# EAGLE schematic Stovetop-v1.1 (EAGLE 9.2.2)

## Sheet 1 of 9
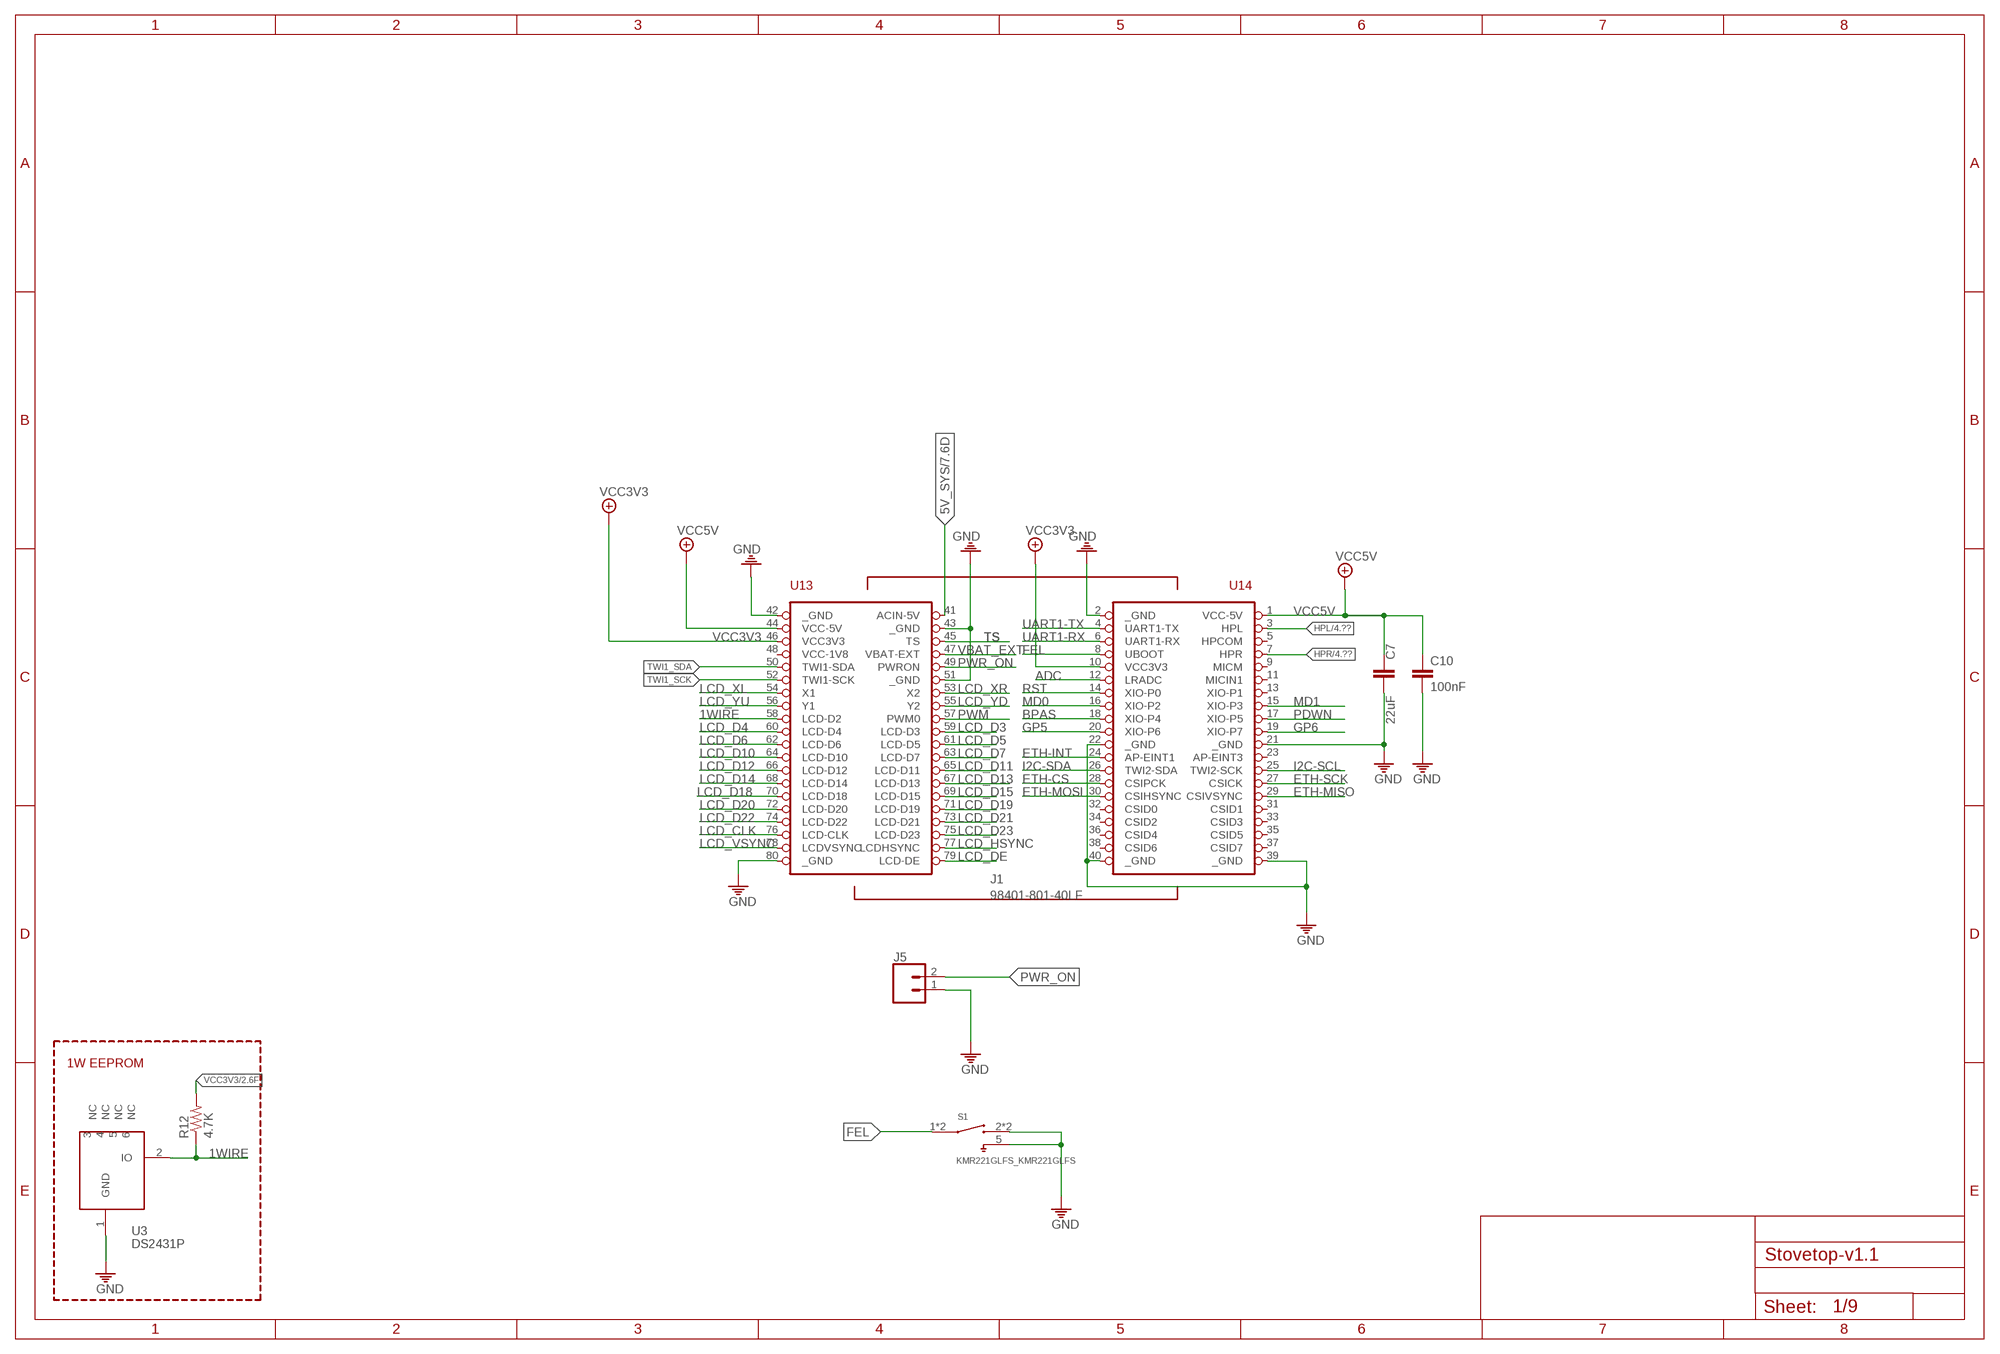
[diagram p0: schematic, sheet 1]

### Parts
C7  22uF  C1206_22UF_50V_10%  [C1206]
C10  100nF  C0402_100NF_50V_10%  [C0402]
J1  98401-801-40LF  [98401-801-40LF]
J5  CONN_02LOCK  [1X02_LOCK]
R12  4.7K  R0402_4K7_5%  [R0402]
S1  KMR221GLFS_KMR221GLFS  [KMR221GLFS_SW_KMR221GLFS]
U3  DS2431P  [TSOC6]

### Nets
1WIRE: J1.58(LCD-D2) R12.1 U3.2(IO)
5V_SYS: J1.41(ACIN-5V) ; also sheet 7,8,9
ADC: J1.12(LRADC)
BPAS: J1.18(XIO-P4) ; also sheet 4
ETH-CS: J1.28(CSIPCK) ; also sheet 2
ETH-INT: J1.24(AP-EINT1) ; also sheet 2
ETH-MISO: J1.29(CSIVSYNC) ; also sheet 2
ETH-MOSI: J1.30(CSIHSYNC) ; also sheet 2
ETH-SCK: J1.27(CSICK) ; also sheet 2
FEL: J1.8(UBOOT) S1.1 S1.4
GND: C7.2 C10.2 J1.2(_GND) J1.21(_GND) J1.22(_GND) J1.39(_GND) J1.40(_GND) J1.42(_GND) J1.43(_GND) J1.51(_GND) J1.80(_GND) J5.1 S1.2 S1.3 S1.5 U3.1(GND) ; also sheet 2,3,4,5,6,7,8,9
GP5: J1.20(XIO-P6)
GP6: J1.19(XIO-P7)
HPL: J1.3(HPL) ; also sheet 4
HPR: J1.7(HPR) ; also sheet 4
I2C-SCL: J1.25(TWI2-SCK) ; also sheet 7
I2C-SDA: J1.26(TWI2-SDA) ; also sheet 7
LCD_CLK: J1.76(LCD-CLK) ; also sheet 5
LCD_D3: J1.59(LCD-D3) ; also sheet 5
LCD_D4: J1.60(LCD-D4) ; also sheet 5
LCD_D5: J1.61(LCD-D5) ; also sheet 5
LCD_D6: J1.62(LCD-D6) ; also sheet 5
LCD_D7: J1.63(LCD-D7) ; also sheet 5
LCD_D10: J1.64(LCD-D10) ; also sheet 5
LCD_D11: J1.65(LCD-D11) ; also sheet 5
LCD_D12: J1.66(LCD-D12) ; also sheet 5
LCD_D13: J1.67(LCD-D13) ; also sheet 5
LCD_D14: J1.68(LCD-D14) ; also sheet 5
LCD_D15: J1.69(LCD-D15) ; also sheet 5
LCD_D18: J1.70(LCD-D18) ; also sheet 5
LCD_D19: J1.71(LCD-D19) ; also sheet 5
LCD_D20: J1.72(LCD-D20) ; also sheet 5
LCD_D21: J1.73(LCD-D21) ; also sheet 5
LCD_D22: J1.74(LCD-D22) ; also sheet 5
LCD_D23: J1.75(LCD-D23) ; also sheet 5
LCD_DE: J1.79(LCD-DE) ; also sheet 5
LCD_HSYNC: J1.77(LCDHSYNC) ; also sheet 5
LCD_VSYNC: J1.78(LCDVSYNC) ; also sheet 5
LCD_XL: J1.54(X1)
LCD_XR: J1.53(X2)
LCD_YD: J1.55(Y2)
LCD_YU: J1.56(Y1)
MD0: J1.16(XIO-P2) ; also sheet 4
MD1: J1.15(XIO-P3) ; also sheet 4
PDWN: J1.17(XIO-P5) ; also sheet 4
PWM: J1.57(PWM0)
PWR_ON: J1.49(PWRON) J5.2
RST: J1.14(XIO-P0) ; also sheet 5
TS: J1.45(TS)
TWI1_SCK: J1.52(TWI1-SCK) ; also sheet 5,6
TWI1_SDA: J1.50(TWI1-SDA) ; also sheet 5,6
UART1-RX: J1.6(UART1-RX) ; also sheet 9
UART1-TX: J1.4(UART1-TX) ; also sheet 9
VBAT_EXT: J1.47(VBAT-EXT)
VCC3V3: J1.10(VCC3V3) J1.46(VCC3V3) R12.2 ; also sheet 2,3,4,5,9
VCC5V: C7.1 C10.1 J1.1(VCC-5V) J1.44(VCC-5V) ; also sheet 3,4
Unconnected: J1.5(HPCOM) J1.9(MICM) J1.11(MICIN1) J1.13(XIO-P1) J1.23(AP-EINT3) J1.31(CSID1) J1.32(CSID0) J1.33(CSID3) J1.34(CSID2) J1.35(CSID5) J1.36(CSID4) J1.37(CSID7) J1.38(CSID6) J1.48(VCC-1V8) U3.3(NC) U3.4(NC) U3.5(NC) U3.6(NC)

### Notes on the sheet
- 1W EEPROM

## Sheet 2 of 9
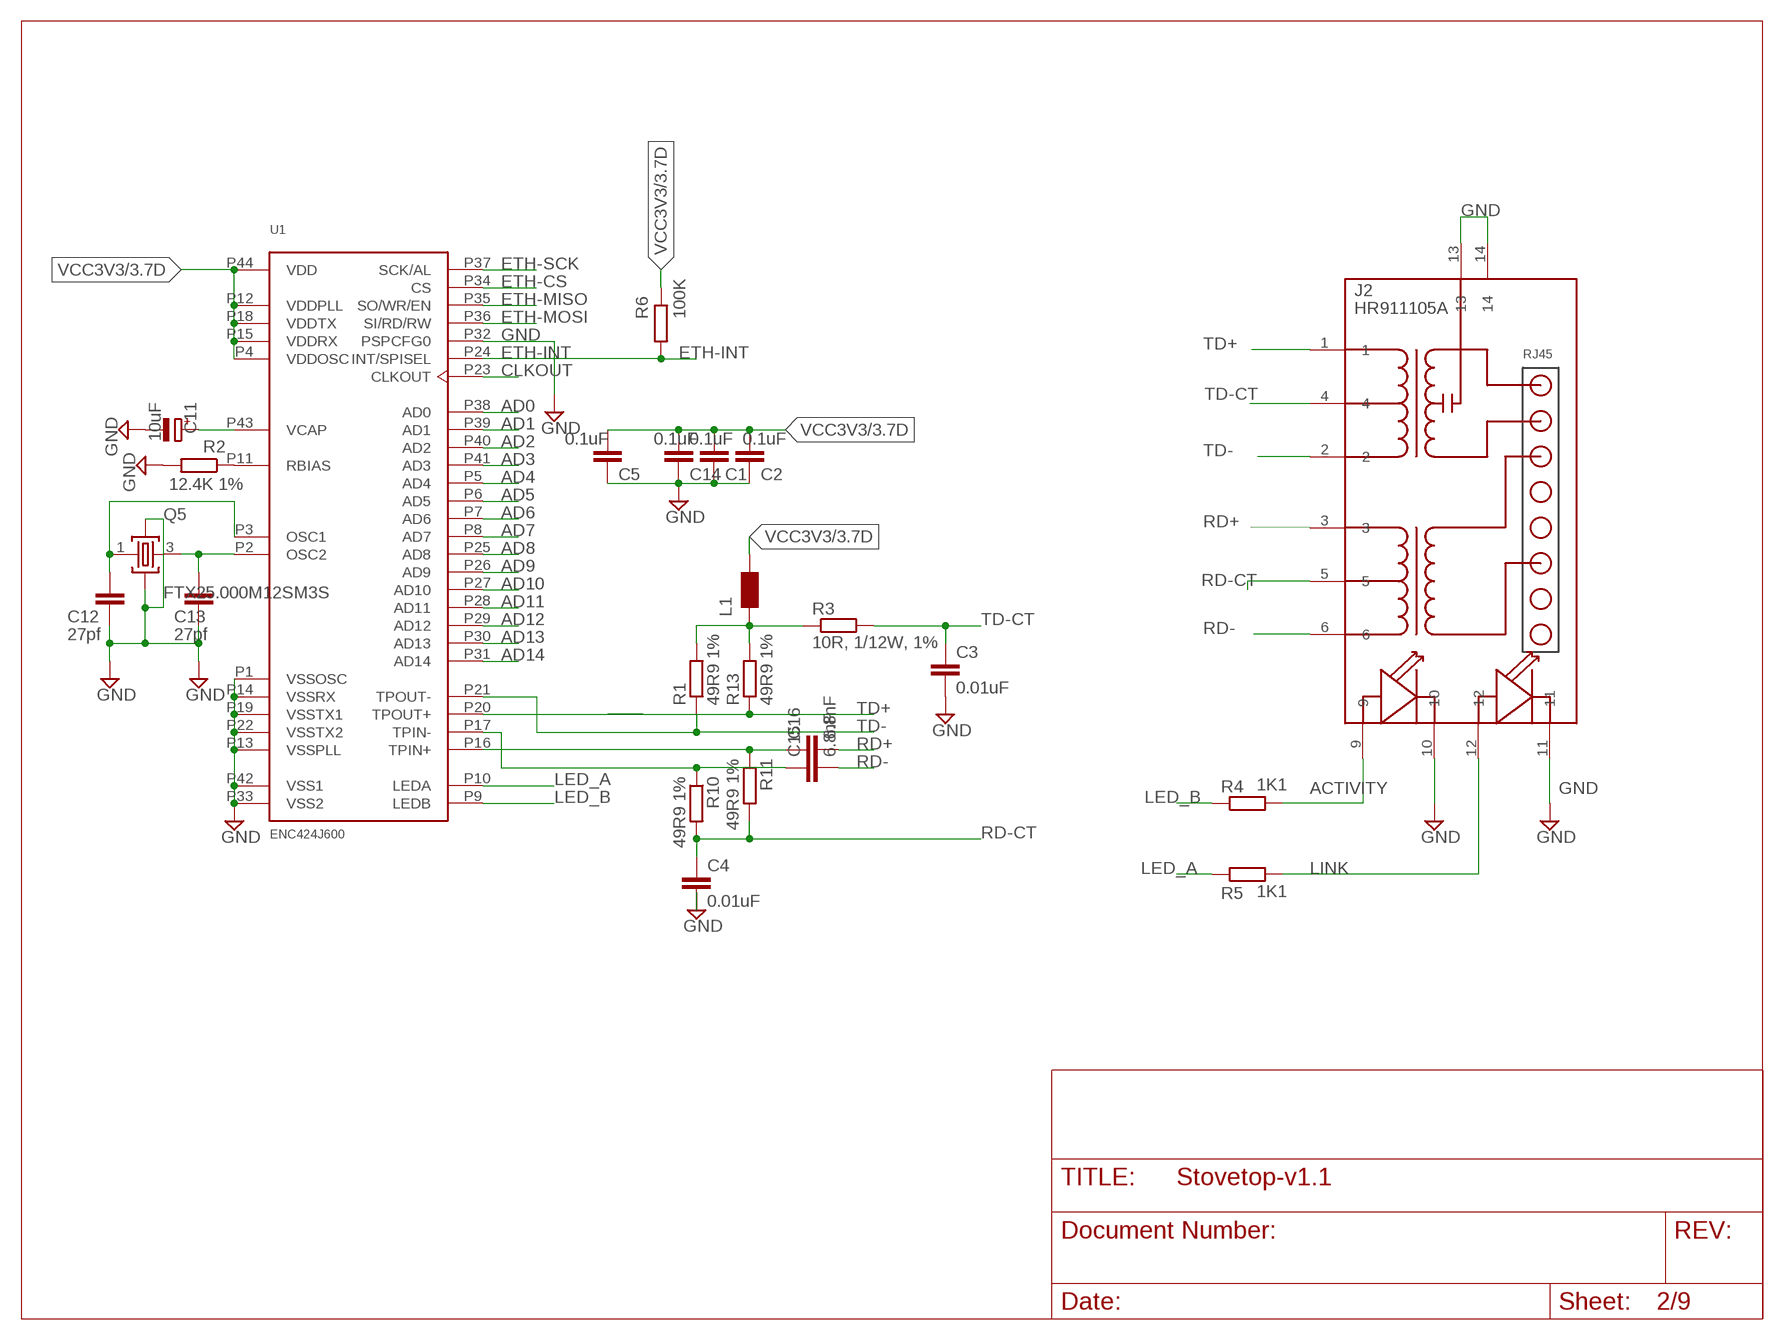
[diagram p1: schematic, sheet 2]

### Parts
C1  0.1uF  C-EUC0603  [C0603]
C2  0.1uF  C-EUC0603  [C0603]
C3  0.01uF  C-EUC0603  [C0603]
C4  0.01uF  C-EUC0603  [C0603]
C5  0.1uF  C-EUC0603  [C0603]
C11  10uF  CPOL-EUSMCA  [SMC_A]
C12  27pf  C-EUC0603  [C0603]
C13  27pf  C-EUC0603  [C0603]
C14  0.1uF  C-EUC0603  [C0603]
C15  6.8nF  C-EUC0603  [C0603]
C16  6.8nF  C-EUC0603  [C0603]
J2  HR911105A  [HR911105A]
L1  WE-KIL_0805  [WE-KI_0805_B]
Q5  FTX25.000M12SM3S  CRISTALLI_0846_FTX25.000M12SM3S  [CRISTALLI_CRYSTAL3.2X2.5]
R1  49R9 1%  R-EU_R0603  [R0603]
R2  12.4K 1%  R-EU_R0603  [R0603]
R3  10R, 1/12W, 1%  R-EU_R0603  [R0603]
R4  1K1  R-EU_R0603  [R0603]
R5  1K1  R-EU_R0603  [R0603]
R6  100K  R-EU_R0603  [R0603]
R10  49R9 1%  R-EU_R0603  [R0603]
R11  49R9 1%  R-EU_R0603  [R0603]
R13  49R9 1%  R-EU_R0603  [R0603]
U1  ENC424J600  [TQFP44]

### Nets
ACTIVITY: J2.9 R4.2
AD0: U1.P38(AD0)
AD1: U1.P39(AD1)
AD2: U1.P40(AD2)
AD3: U1.P41(AD3)
AD4: U1.P5(AD4)
AD5: U1.P6(AD5)
AD6: U1.P7(AD6)
AD7: U1.P8(AD7)
AD8: U1.P25(AD8)
AD9: U1.P26(AD9)
AD10: U1.P27(AD10)
AD11: U1.P28(AD11)
AD12: U1.P29(AD12)
AD13: U1.P30(AD13)
AD14: U1.P31(AD14)
CCT: L1.2 R1.2 R3.1 R13.2
CLKOUT: U1.P23(CLKOUT)
DSFGDF: C15.1 R10.1 U1.P17(TPIN-)
DSGDFSG: C16.1 R11.1 U1.P16(TPIN+)
ETH-CS: U1.P34(CS) ; also sheet 1
ETH-INT: R6.2 U1.P24(INT/SPISEL) ; also sheet 1
ETH-MISO: U1.P35(SO/WR/EN) ; also sheet 1
ETH-MOSI: U1.P36(SI/RD/RW) ; also sheet 1
ETH-SCK: U1.P37(SCK/AL) ; also sheet 1
GND: C1.2 C2.2 C3.2 C4.2 C5.2 C11.- C12.2 C13.2 C14.2 J2.10 J2.11 J2.13 J2.14 Q5.2 Q5.4 R2.2 U1.P1(VSSOSC) U1.P13(VSSPLL) U1.P14(VSSRX) U1.P19(VSSTX1) U1.P22(VSSTX2) U1.P32(PSPCFG0) U1.P33(VSS2) U1.P42(VSS1) ; also sheet 1,3,4,5,6,7,8,9
LED_A: R5.1 U1.P10(LEDA)
LED_B: R4.1 U1.P9(LEDB)
LINK: J2.12 R5.2
N$50: C11.+ U1.P43(VCAP)
N$51: R2.1 U1.P11(RBIAS)
N$73: C12.1 Q5.1 U1.P3(OSC1)
N$74: C13.1 Q5.3 U1.P2(OSC2)
RD+: C16.2 J2.3
RD-: C15.2 J2.6
RD-CT: C4.1 J2.5 R10.2 R11.2
TD+: J2.1 R13.1 U1.P20(TPOUT+)
TD-: J2.2 R1.1 U1.P21(TPOUT-)
TD-CT: C3.1 J2.4 R3.2
VCC3V3: C1.1 C2.1 C5.1 C14.1 L1.1 R6.1 U1.P4(VDDOSC) U1.P12(VDDPLL) U1.P15(VDDRX) U1.P18(VDDTX) U1.P44(VDD) ; also sheet 1,3,4,5,9

## Sheet 3 of 9
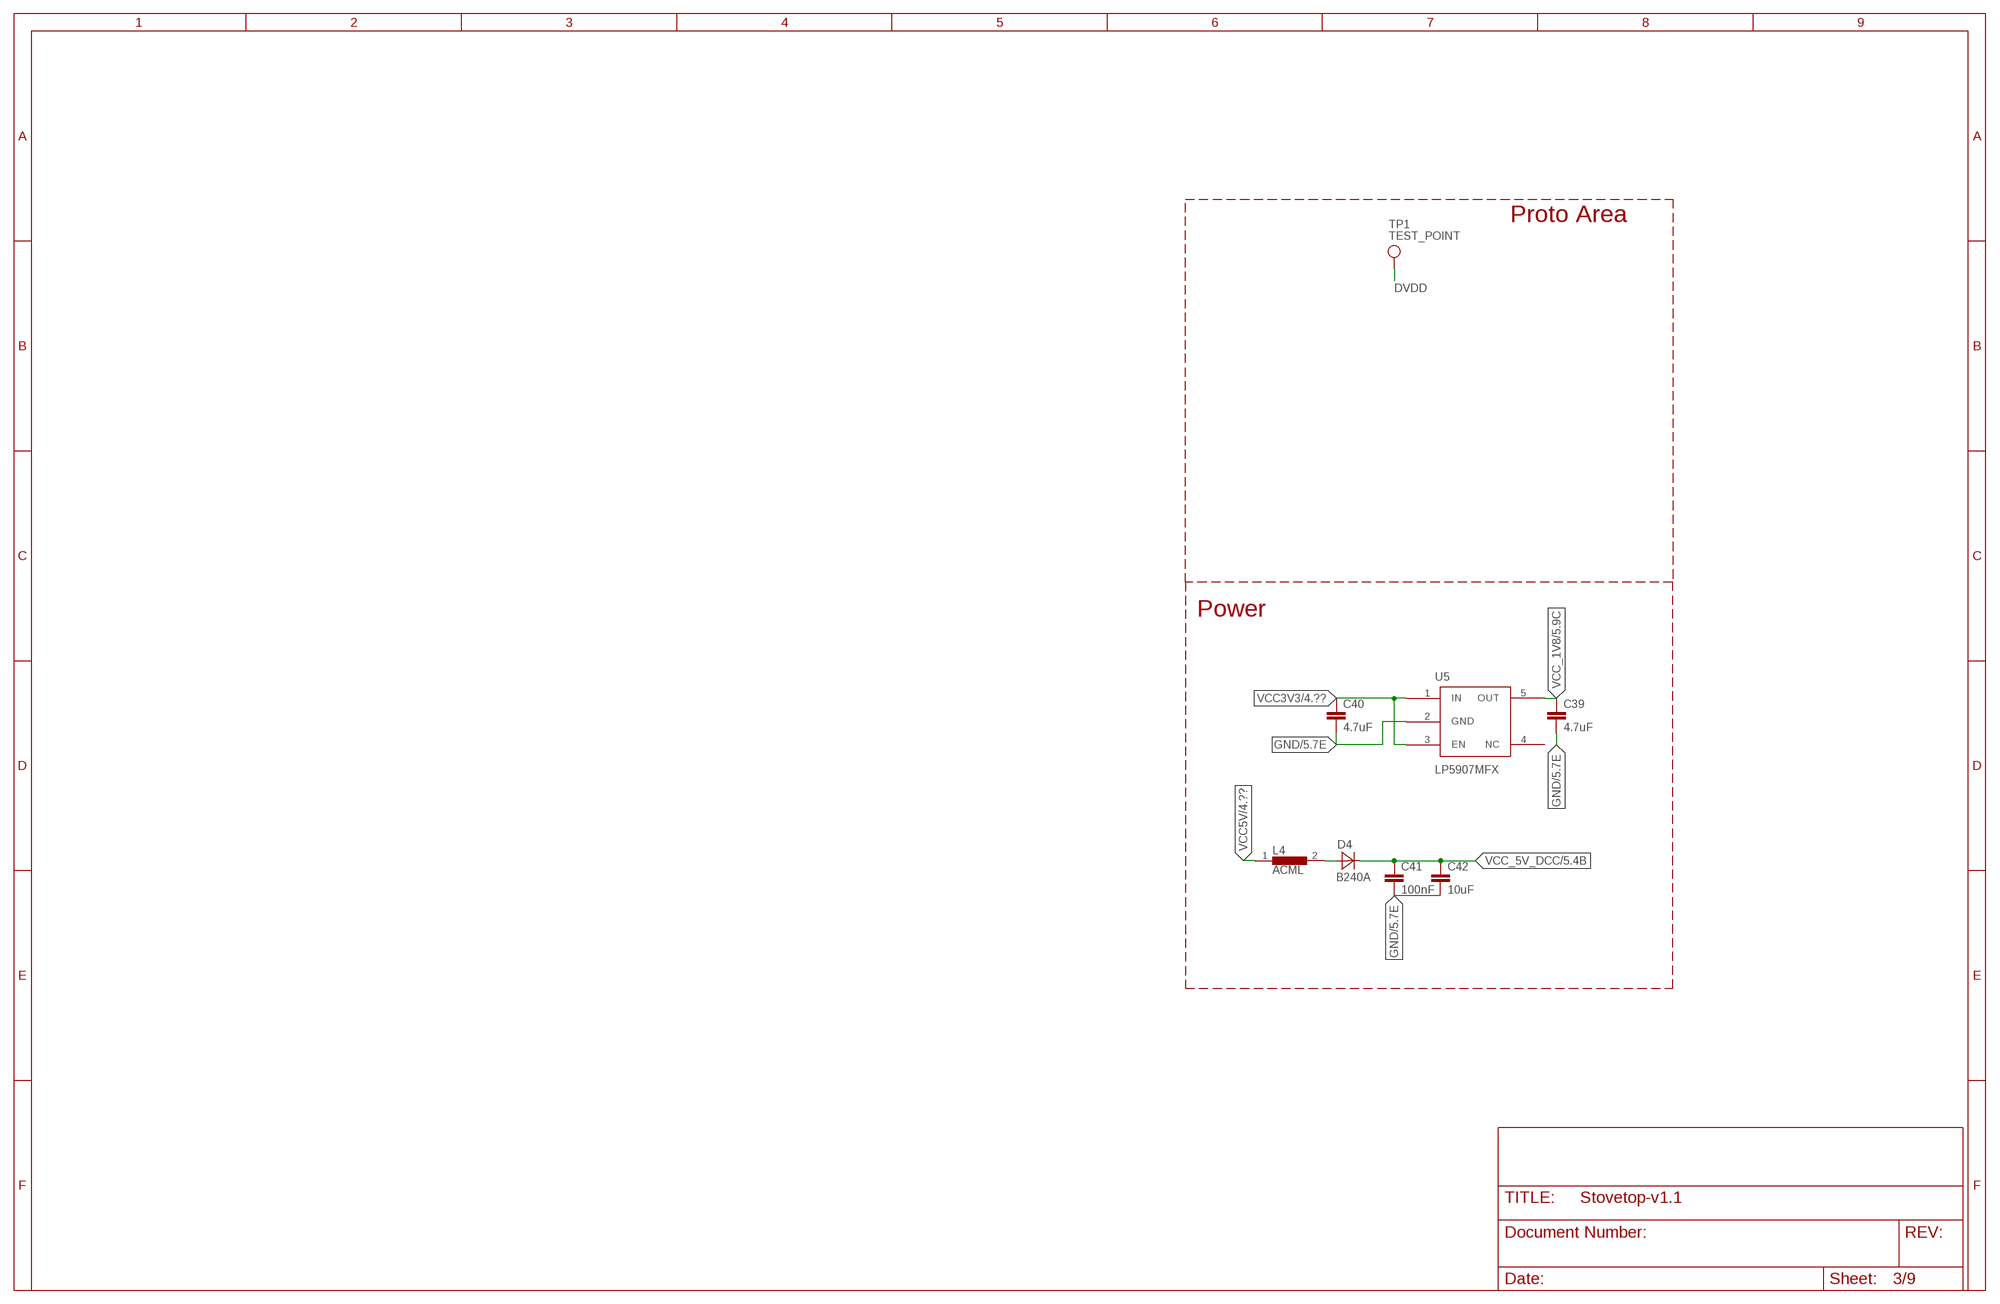
[diagram p2: schematic, sheet 3]

### Parts
C39  4.7uF  CAPACITOR  [1608_0603]
C40  4.7uF  CAPACITOR  [1608_0603]
C41  100nF  CAPACITOR  [1608_0603]
C42  10uF  CAPACITOR  [1608_0603]
D4  B240A  [SMA]
L4  ACML  [0603]
TP1  TEST_POINT  [TP-1MMX1MM]
U5  LP5907MFX  [SOT23-5]

### Nets
DVDD: TP1.0 ; also sheet 5
GND: C39.2 C40.2 C41.2 C42.2 U5.2(GND) ; also sheet 1,2,4,5,6,7,8,9
N$1: D4.1(A) L4.2
VCC3V3: C40.1 U5.1(IN) U5.3(EN) ; also sheet 1,2,4,5,9
VCC5V: L4.1 ; also sheet 1,4
VCC_1V8: C39.1 U5.5(OUT) ; also sheet 5
VCC_5V_DCC: C41.1 C42.1 D4.2(C) ; also sheet 5,6
Unconnected: U5.4(NC)

### Notes on the sheet
- Proto Area
- Power

## Sheet 4 of 9
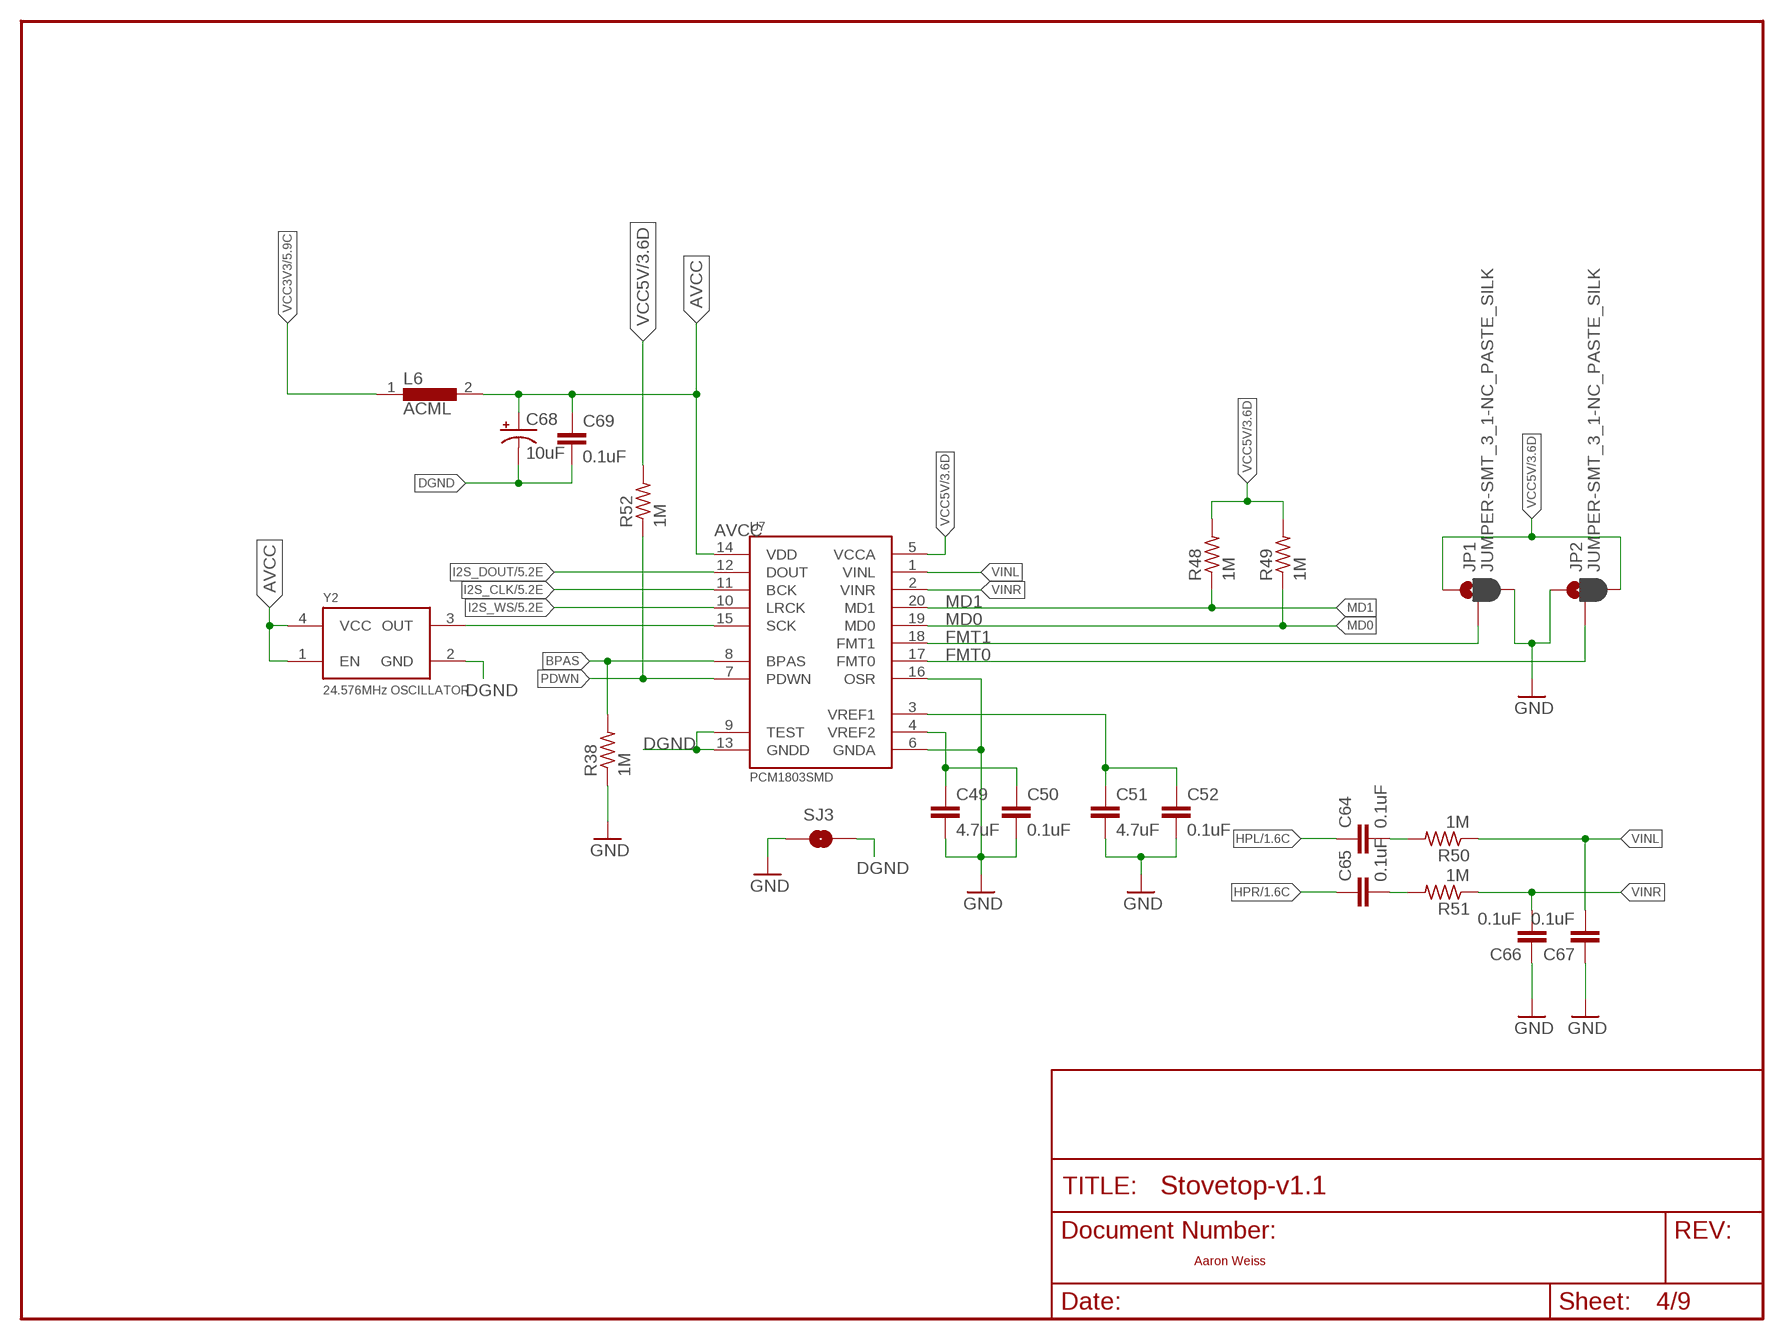
[diagram p3: schematic, sheet 4]

### Parts
C49  4.7uF  4.7UF-0603-6.3V-(10%)  [0603]
C50  0.1uF  CAP0402-CAP  [0402-CAP]
C51  4.7uF  4.7UF-0603-6.3V-(10%)  [0603]
C52  0.1uF  CAP0402-CAP  [0402-CAP]
C64  0.1uF  CAP0402-CAP  [0402-CAP]
C65  0.1uF  CAP0402-CAP  [0402-CAP]
C66  0.1uF  CAP0402-CAP  [0402-CAP]
C67  0.1uF  CAP0402-CAP  [0402-CAP]
C68  10uF  CAP_POL1206  [EIA3216]
C69  0.1uF  CAP0402-CAP  [0402-CAP]
JP1  JUMPER-SMT_3_1-NC_PASTE_SILK  [SMT-JUMPER_3_1-NC_PASTE_SILK]
JP2  JUMPER-SMT_3_1-NC_PASTE_SILK  [SMT-JUMPER_3_1-NC_PASTE_SILK]
L6  ACML  [0603]
R38  1M  RESISTOR  [J1-0603]
R48  1M  RESISTOR  [J1-0603]
R49  1M  RESISTOR  [J1-0603]
R50  1M  RESISTOR  [J1-0603]
R51  1M  RESISTOR  [J1-0603]
R52  1M  RESISTOR  [J1-0603]
SJ3  SOLDERJUMPERTRACE  [SJ_2S-TRACE]
U7  PCM1803SMD  [SSOP20]
Y2  24.576MHz OSCILLATOR  OSCILLATORSMD6  [CRYSTAL-SMD-7.5X5.2-6PIN]

### Nets
AVCC: C68.A(+) C69.1 L6.2 U7.14(VDD) Y2.1(EN) Y2.4(VCC)
BPAS: R38.2 U7.8(BPAS) ; also sheet 1
DGND: C68.C(-) C69.2 SJ3.2 U7.9(TEST) U7.13(GNDD) Y2.2(GND)
FMT0: JP2.2 U7.17(FMT0)
FMT1: JP1.2 U7.18(FMT1)
GND: C49.2 C50.2 C51.2 C52.2 C66.1 C67.1 JP1.3 JP2.1 R38.1 SJ3.1 U7.6(GNDA) U7.16(OSR) ; also sheet 1,2,3,5,6,7,8,9
HPL: C64.1 ; also sheet 1
HPR: C65.1 ; also sheet 1
I2S_CLK: U7.11(BCK) ; also sheet 5
I2S_DOUT: U7.12(DOUT) ; also sheet 5
I2S_WS: U7.10(LRCK) ; also sheet 5
MD0: R49.1 U7.19(MD0) ; also sheet 1
MD1: R48.1 U7.20(MD1) ; also sheet 1
N$37: C49.1 C50.1 U7.4(VREF2)
N$38: C51.1 C52.1 U7.3(VREF1)
N$39: U7.15(SCK) Y2.3(OUT)
N$71: C64.2 R50.2
N$72: C65.2 R51.2
PDWN: R52.1 U7.7(PDWN) ; also sheet 1
VCC3V3: L6.1 ; also sheet 1,2,3,5,9
VCC5V: JP1.1 JP2.3 R48.2 R49.2 R52.2 U7.5(VCCA) ; also sheet 1,3
VINL: C67.2 R50.1 U7.1(VINL)
VINR: C66.2 R51.1 U7.2(VINR)

### Notes on the sheet
- Aaron Weiss

## Sheet 5 of 9
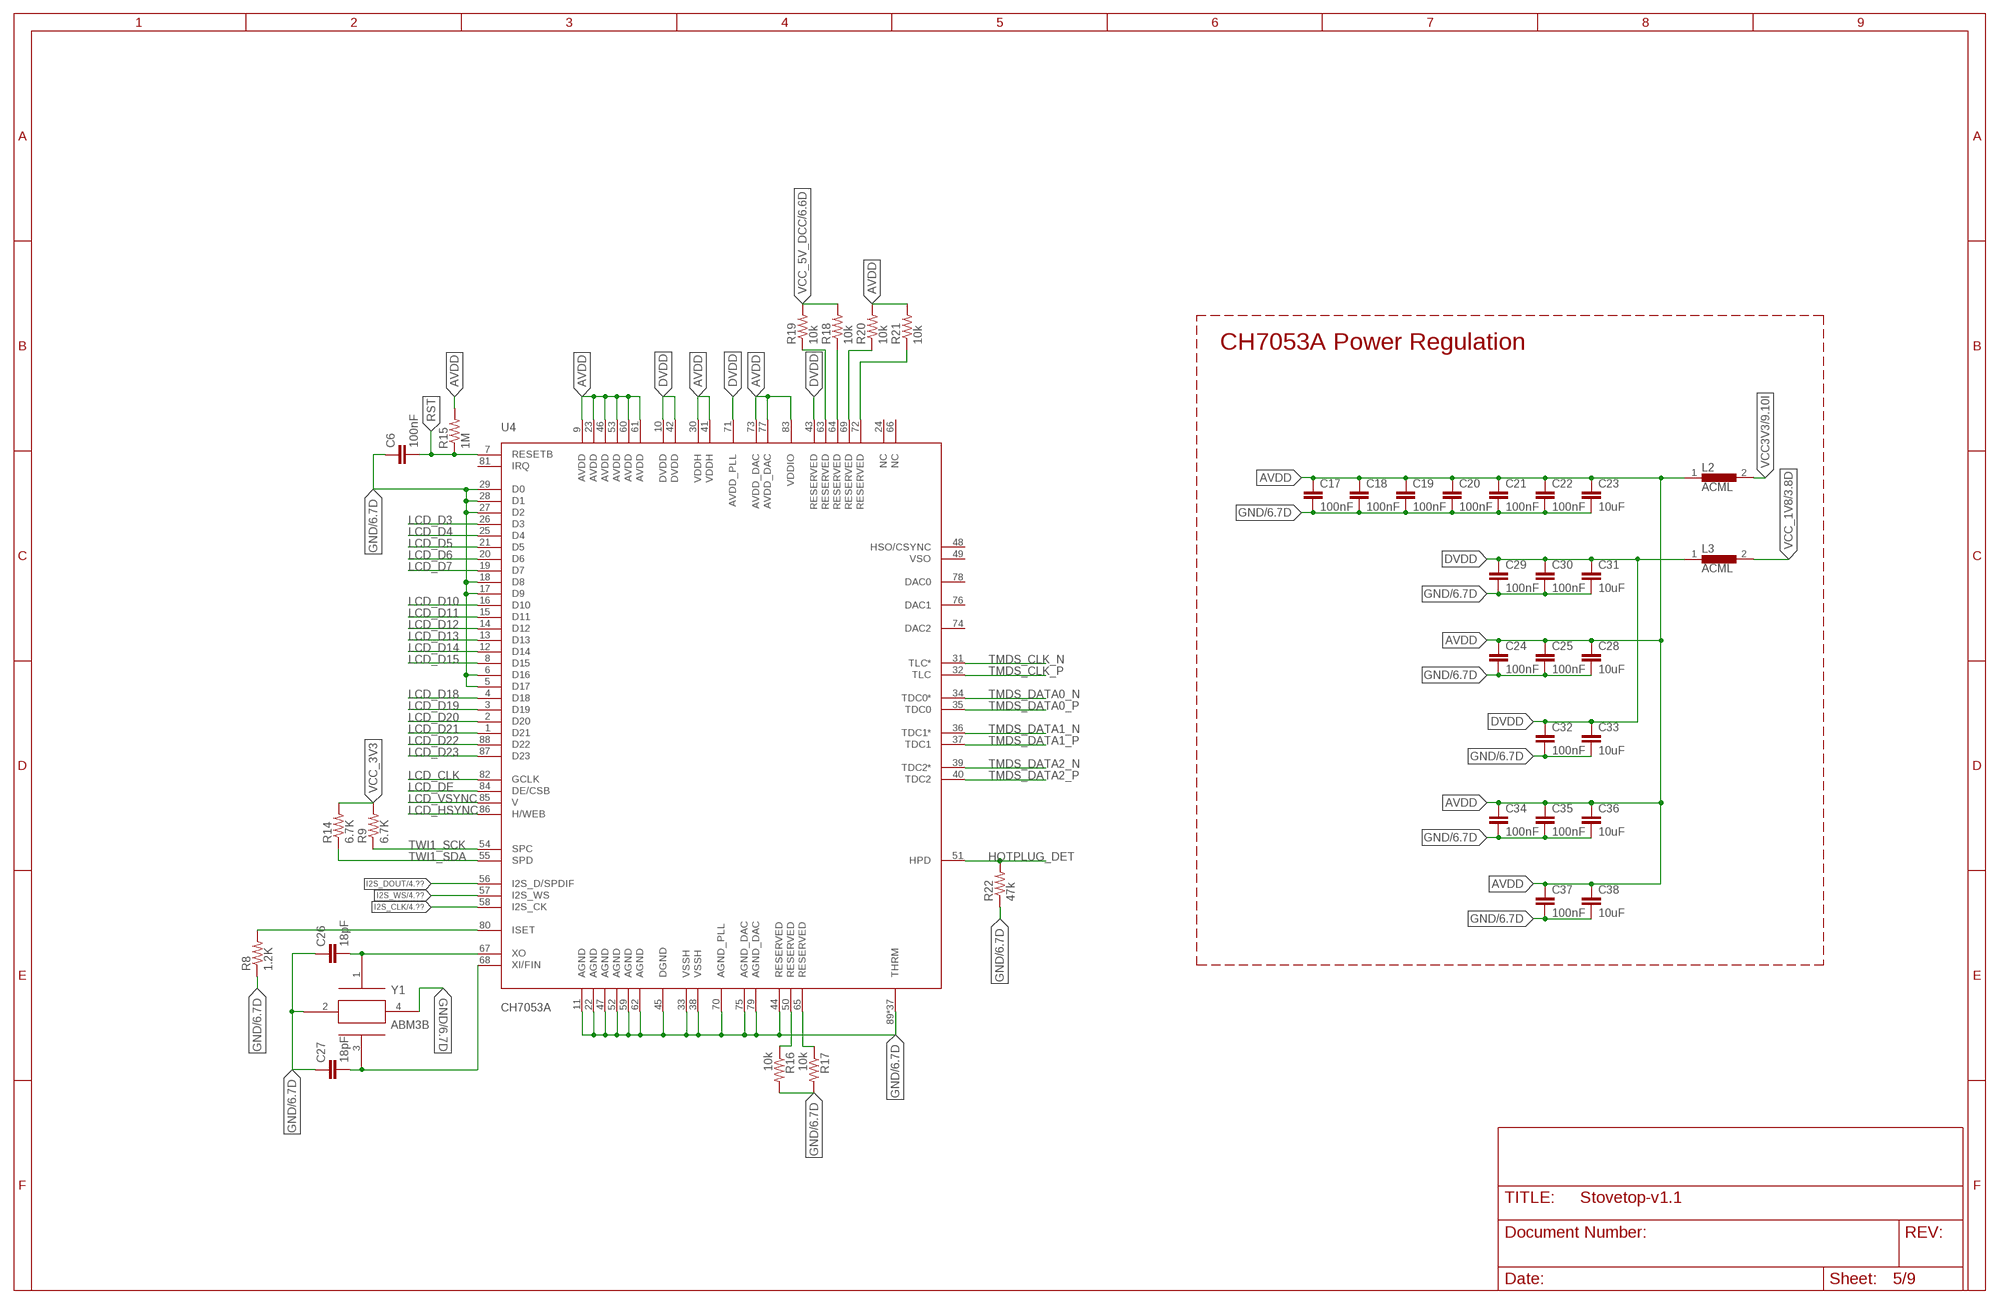
[diagram p4: schematic, sheet 5]

### Parts
C6  100nF  CAPACITOR  [1608_0603]
C17  100nF  CAPACITOR  [1608_0603]
C18  100nF  CAPACITOR  [1608_0603]
C19  100nF  CAPACITOR  [1608_0603]
C20  100nF  CAPACITOR  [1608_0603]
C21  100nF  CAPACITOR  [1608_0603]
C22  100nF  CAPACITOR  [1608_0603]
C23  10uF  CAPACITOR  [1608_0603]
C24  100nF  CAPACITOR  [1608_0603]
C25  100nF  CAPACITOR  [1608_0603]
C26  18pF  CAPACITOR  [1608_0603]
C27  18pF  CAPACITOR  [1608_0603]
C28  10uF  CAPACITOR  [1608_0603]
C29  100nF  CAPACITOR  [1608_0603]
C30  100nF  CAPACITOR  [1608_0603]
C31  10uF  CAPACITOR  [1608_0603]
C32  100nF  CAPACITOR  [1608_0603]
C33  10uF  CAPACITOR  [1608_0603]
C34  100nF  CAPACITOR  [1608_0603]
C35  100nF  CAPACITOR  [1608_0603]
C36  10uF  CAPACITOR  [1608_0603]
C37  100nF  CAPACITOR  [1608_0603]
C38  10uF  CAPACITOR  [1608_0603]
L2  ACML  [0603]
L3  ACML  [0603]
R8  1.2K  RESISTOR  [J1-0603]
R9  6.7K  RESISTOR  [J1-0603]
R14  6.7K  RESISTOR  [J1-0603]
R15  1M  RESISTOR  [J1-0603]
R16  10k  RESISTOR  [J1-0603]
R17  10k  RESISTOR  [J1-0603]
R18  10k  RESISTOR  [J1-0603]
R19  10k  RESISTOR  [J1-0603]
R20  10k  RESISTOR  [J1-0603]
R21  10k  RESISTOR  [J1-0603]
R22  47k  RESISTOR  [J1-0603]
U4  CH7053A  [QFN40P1000X1000X90_HS-89M]
Y1  ABM3B  [ABM3B]

### Nets
AVDD: C17.1 C18.1 C19.1 C20.1 C21.1 C22.1 C23.1 C24.1 C25.1 C28.1 C34.1 C35.1 C36.1 C37.1 C38.1 L2.1 R15.2 R20.2 R21.2 U4.9(AVDD) U4.23(AVDD) U4.30(VDDH) U4.41(VDDH) U4.46(AVDD) U4.53(AVDD) U4.60(AVDD) U4.61(AVDD) U4.73(AVDD_DAC) U4.77(AVDD_DAC) U4.83(VDDIO)
DVDD: C29.1 C30.1 C31.1 C32.1 C33.1 L3.1 U4.10(DVDD) U4.42(DVDD) U4.43(RESERVED) U4.71(AVDD_PLL) ; also sheet 3
GND: C6.1 C17.2 C18.2 C19.2 C20.2 C21.2 C22.2 C23.2 C24.2 C25.2 C26.1 C27.1 C28.2 C29.2 C30.2 C31.2 C32.2 C33.2 C34.2 C35.2 C36.2 C37.2 C38.2 R8.1 R16.2 R17.2 R22.1 U4.5(D17) U4.6(D16) U4.11(AGND) U4.17(D9) U4.18(D8) U4.22(AGND) U4.27(D2) U4.28(D1) U4.29(D0) U4.33(VSSH) U4.38(VSSH) U4.44(RESERVED) U4.45(DGND) U4.47(AGND) U4.52(AGND) U4.59(AGND) U4.62(AGND) U4.70(AGND_PLL) U4.75(AGND_DAC) U4.79(AGND_DAC) U4.89(THRM) U4.P$1(THRM) U4.P$2(THRM) U4.P$3(THRM) U4.P$4(THRM) U4.P$5(THRM) U4.P$6(THRM) U4.P$7(THRM) U4.P$8(THRM) U4.P$9(THRM) U4.P$10(THRM) U4.P$11(THRM) U4.P$12(THRM) U4.P$13(THRM) U4.P$14(THRM) U4.P$15(THRM) U4.P$16(THRM) U4.P$17(THRM) U4.P$18(THRM) U4.P$19(THRM) U4.P$20(THRM) U4.P$21(THRM) U4.P$22(THRM) U4.P$23(THRM) U4.P$24(THRM) U4.P$25(THRM) U4.P$26(THRM) U4.P$27(THRM) U4.P$28(THRM) U4.P$29(THRM) U4.P$30(THRM) U4.P$31(THRM) U4.P$32(THRM) U4.P$33(THRM) U4.P$34(THRM) U4.P$35(THRM) U4.P$36(THRM) Y1.2 Y1.4 ; also sheet 1,2,3,4,6,7,8,9
HOTPLUG_DET: R22.2 U4.51(HPD) ; also sheet 6
I2S_CLK: U4.58(I2S_CK) ; also sheet 4
I2S_DOUT: U4.56(I2S_D/SPDIF) ; also sheet 4
I2S_WS: U4.57(I2S_WS) ; also sheet 4
LCD_CLK: U4.82(GCLK) ; also sheet 1
LCD_D3: U4.26(D3) ; also sheet 1
LCD_D4: U4.25(D4) ; also sheet 1
LCD_D5: U4.21(D5) ; also sheet 1
LCD_D6: U4.20(D6) ; also sheet 1
LCD_D7: U4.19(D7) ; also sheet 1
LCD_D10: U4.16(D10) ; also sheet 1
LCD_D11: U4.15(D11) ; also sheet 1
LCD_D12: U4.14(D12) ; also sheet 1
LCD_D13: U4.13(D13) ; also sheet 1
LCD_D14: U4.12(D14) ; also sheet 1
LCD_D15: U4.8(D15) ; also sheet 1
LCD_D18: U4.4(D18) ; also sheet 1
LCD_D19: U4.3(D19) ; also sheet 1
LCD_D20: U4.2(D20) ; also sheet 1
LCD_D21: U4.1(D21) ; also sheet 1
LCD_D22: U4.88(D22) ; also sheet 1
LCD_D23: U4.87(D23) ; also sheet 1
LCD_DE: U4.84(DE/CSB) ; also sheet 1
LCD_HSYNC: U4.86(H/WEB) ; also sheet 1
LCD_VSYNC: U4.85(V) ; also sheet 1
N$9: C27.2 U4.68(XI/FIN) Y1.3
N$24: R8.2 U4.80(ISET)
N$25: R16.1 U4.50(RESERVED)
N$26: R17.1 U4.65(RESERVED)
N$27: R19.1 U4.63(RESERVED)
N$28: R18.1 U4.64(RESERVED)
N$30: R21.1 U4.72(RESERVED)
N$31: R20.1 U4.69(RESERVED)
N$32: C26.2 U4.67(XO) Y1.1
RST: C6.2 R15.1 U4.7(RESETB) ; also sheet 1
TMDS_CLK_N: U4.31(TLC*) ; also sheet 6
TMDS_CLK_P: U4.32(TLC) ; also sheet 6
TMDS_DATA0_N: U4.34(TDC0*) ; also sheet 6
TMDS_DATA0_P: U4.35(TDC0) ; also sheet 6
TMDS_DATA1_N: U4.36(TDC1*) ; also sheet 6
TMDS_DATA1_P: U4.37(TDC1) ; also sheet 6
TMDS_DATA2_N: U4.39(TDC2*) ; also sheet 6
TMDS_DATA2_P: U4.40(TDC2) ; also sheet 6
TWI1_SCK: R9.1 U4.54(SPC) ; also sheet 1,6
TWI1_SDA: R14.1 U4.55(SPD) ; also sheet 1,6
VCC3V3: L2.2 ; also sheet 1,2,3,4,9
VCC_1V8: L3.2 ; also sheet 3
VCC_3V3: R9.2 R14.2
VCC_5V_DCC: R18.2 R19.2 ; also sheet 3,6
Unconnected: U4.24(NC) U4.48(HSO/CSYNC) U4.49(VSO) U4.66(NC) U4.74(DAC2) U4.76(DAC1) U4.78(DAC0) U4.81(IRQ)

### Notes on the sheet
- CH7053A Power Regulation

## Sheet 6 of 9
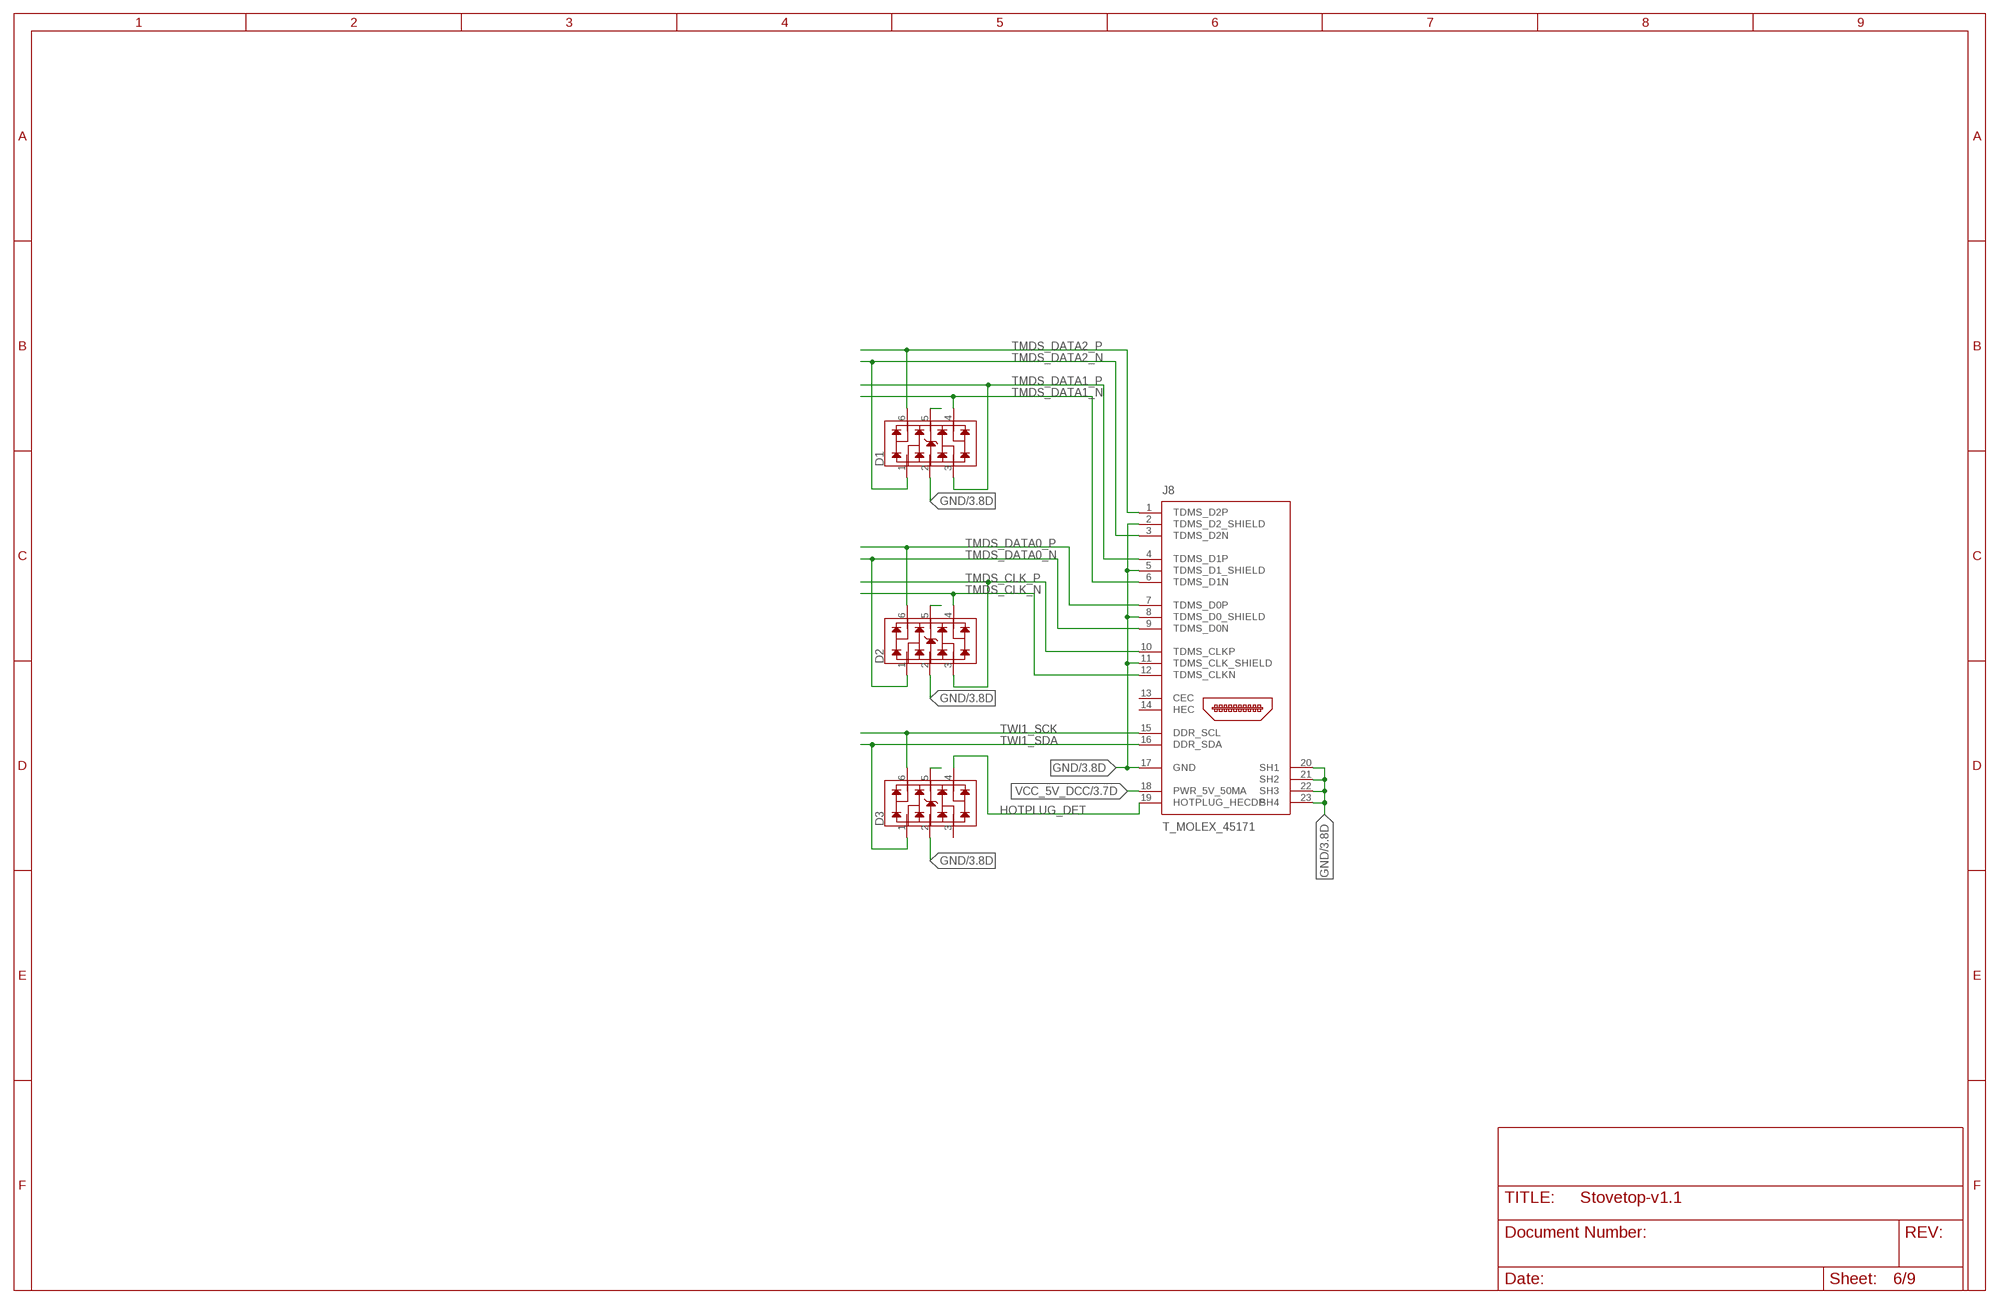
[diagram p5: schematic, sheet 6]

### Parts
D1  D-SEMTECH-RCLAMP0504S  [T_SOT95P285X90-6N]
D2  D-SEMTECH-RCLAMP0504S  [T_SOT95P285X90-6N]
D3  D-SEMTECH-RCLAMP0504S  [T_SOT95P285X90-6N]
J8  T_MOLEX_45171  [T_MOLEX_45171]

### Nets
GND: D1.2 D2.2 D3.2 J8.2(TDMS_D2_SHIELD) J8.5(TDMS_D1_SHIELD) J8.8(TDMS_D0_SHIELD) J8.11(TDMS_CLK_SHIELD) J8.17(GND) J8.20(SH1) J8.21(SH2) J8.22(SH3) J8.23(SH4) ; also sheet 1,2,3,4,5,7,8,9
HOTPLUG_DET: D3.4 J8.19(HOTPLUG_HECDP) ; also sheet 5
N$33: D1.5
N$35: D2.5
N$36: D3.5
TMDS_CLK_N: D2.4 J8.12(TDMS_CLKN) ; also sheet 5
TMDS_CLK_P: D2.3 J8.10(TDMS_CLKP) ; also sheet 5
TMDS_DATA0_N: D2.1 J8.9(TDMS_D0N) ; also sheet 5
TMDS_DATA0_P: D2.6 J8.7(TDMS_D0P) ; also sheet 5
TMDS_DATA1_N: D1.4 J8.6(TDMS_D1N) ; also sheet 5
TMDS_DATA1_P: D1.3 J8.4(TDMS_D1P) ; also sheet 5
TMDS_DATA2_N: D1.1 J8.3(TDMS_D2N) ; also sheet 5
TMDS_DATA2_P: D1.6 J8.1(TDMS_D2P) ; also sheet 5
TWI1_SCK: D3.6 J8.15(DDR_SCL) ; also sheet 1,5
TWI1_SDA: D3.1 J8.16(DDR_SDA) ; also sheet 1,5
VCC_5V_DCC: J8.18(PWR_5V_50MA) ; also sheet 3,5
Unconnected: D3.3 J8.13(CEC) J8.14(HEC)

## Sheet 7 of 9
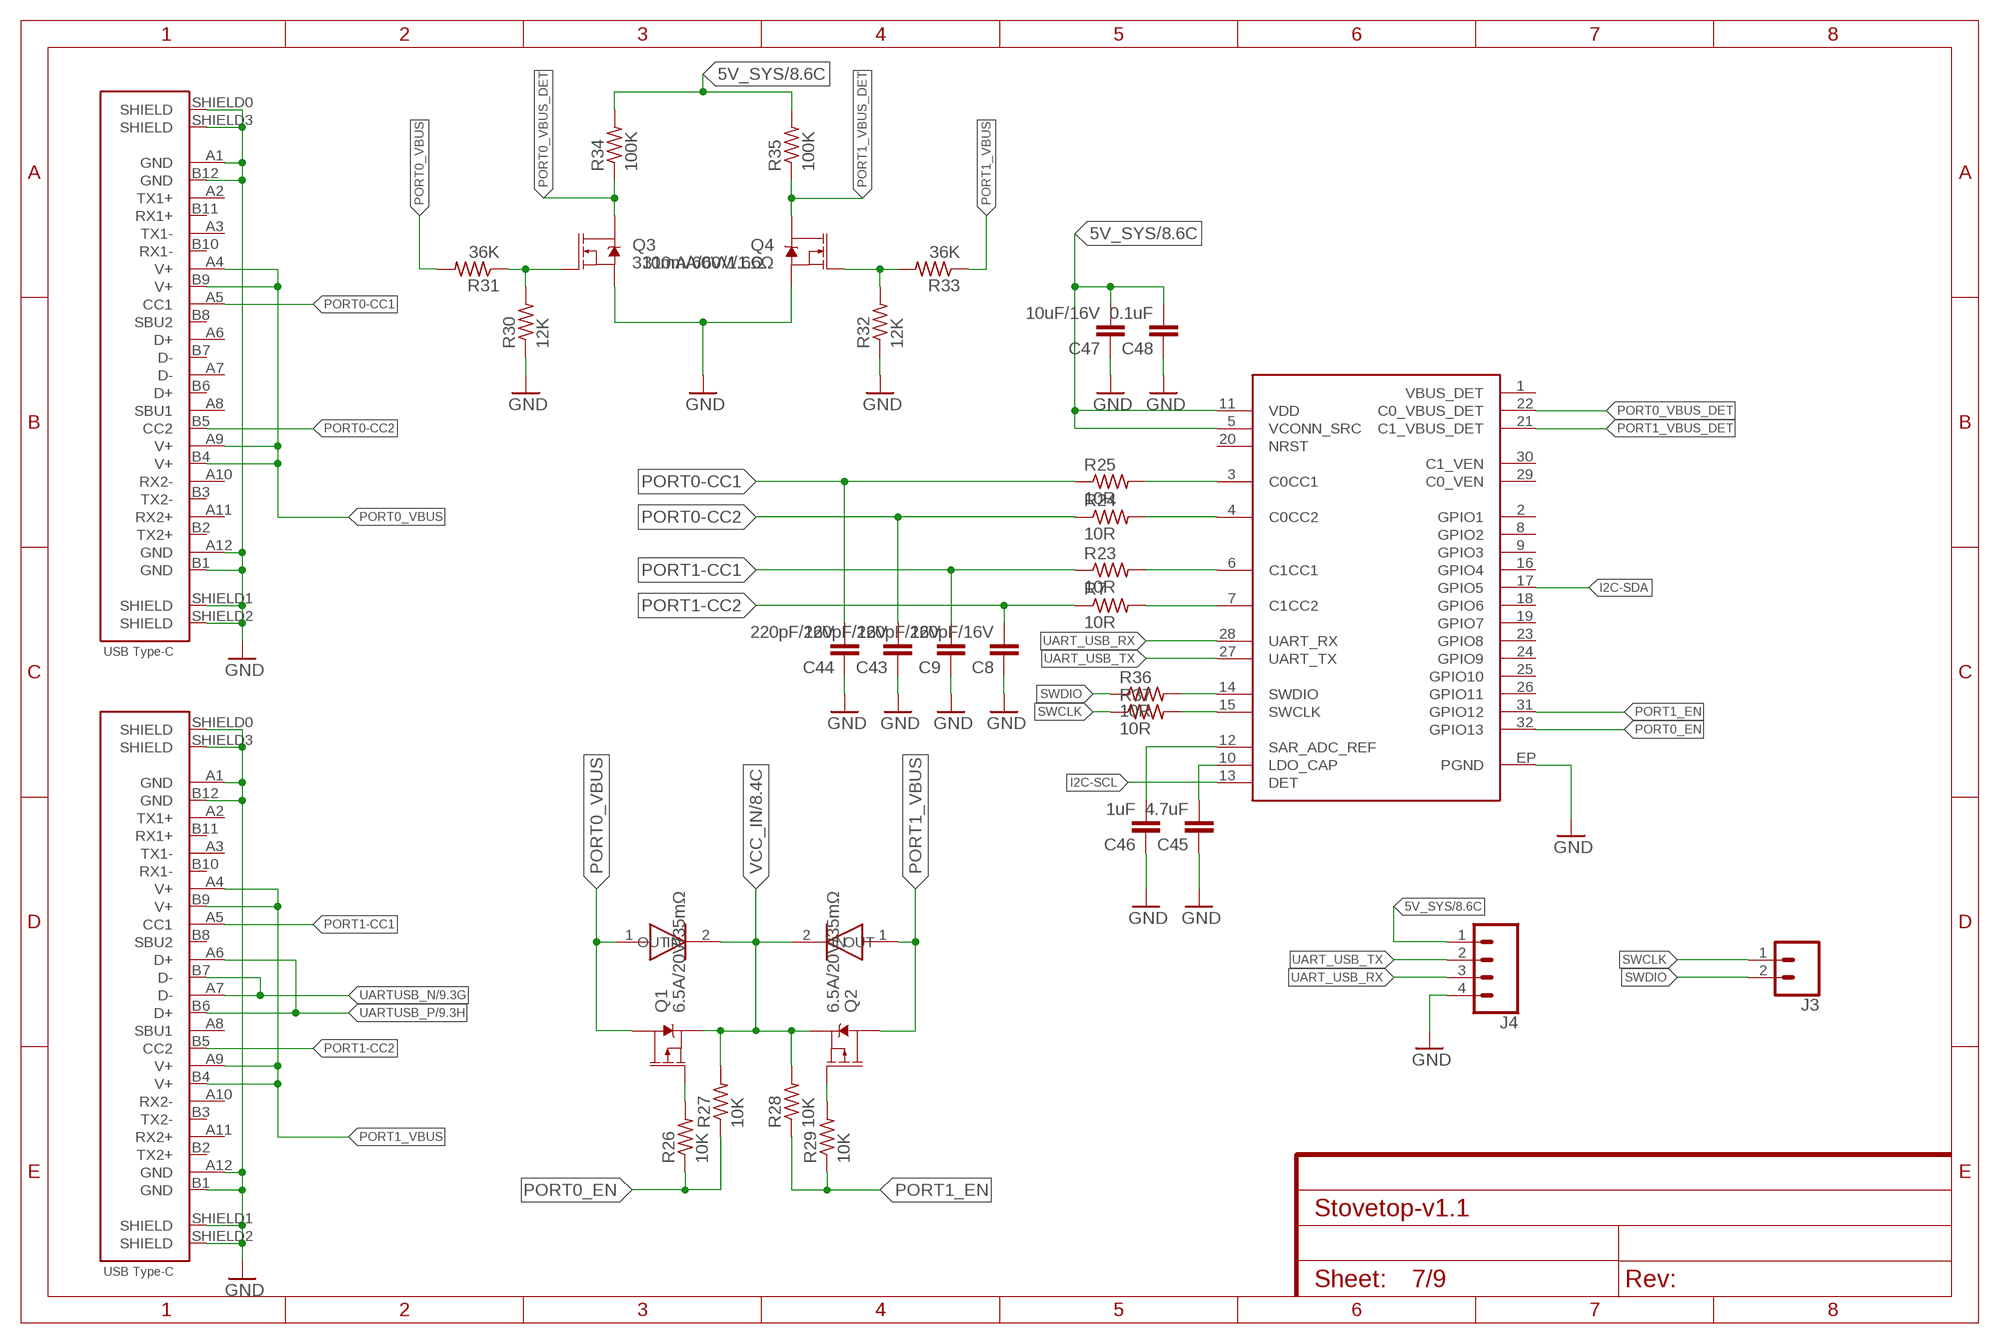
[diagram p6: schematic, sheet 7]

### Parts
C8  220pF/16V  CAP0402-CAP  [0402-CAP]
C9  220pF/16V  CAP0402-CAP  [0402-CAP]
C43  220pF/16V  CAP0402-CAP  [0402-CAP]
C44  220pF/16V  CAP0402-CAP  [0402-CAP]
C45  4.7uF  CAP0402-CAP  [0402-CAP]
C46  1uF  CAP0402-CAP  [0402-CAP]
C47  10uF/16V  CAP0402-CAP  [0402-CAP]
C48  0.1uF  CAP0402-CAP  [0402-CAP]
D5  SMA-SS34  [SMA-SS34]
D6  SMA-SS34  [SMA-SS34]
J3  CONN_02LOCK  [1X02_LOCK]
J4  CONN_04LOCK  [1X04_LOCK]
Q1  6.5A/20V/35mΩ  MOSFET_PCH-NDS8434  [SO08]
Q2  6.5A/20V/35mΩ  MOSFET_PCH-NDS8434  [SO08]
Q3  310mA/60V/1.6Ω  MOSFET-NCH-2N7002PW  [SOT323]
Q4  310mA/60V/1.6Ω  MOSFET-NCH-2N7002PW  [SOT323]
R7  10R  RESISTOR  [J1-0603]
R23  10R  RESISTOR  [J1-0603]
R24  10R  RESISTOR  [J1-0603]
R25  10R  RESISTOR  [J1-0603]
R26  10K  RESISTOR  [J1-0603]
R27  10K  RESISTOR  [J1-0603]
R28  10K  RESISTOR  [J1-0603]
R29  10K  RESISTOR  [J1-0603]
R30  12K  RESISTOR  [J1-0603]
R31  36K  RESISTOR  [J1-0603]
R32  12K  RESISTOR  [J1-0603]
R33  36K  RESISTOR  [J1-0603]
R34  100K  RESISTOR  [J1-0603]
R35  100K  RESISTOR  [J1-0603]
R36  10R  RESISTOR  [J1-0603]
R37  10R  RESISTOR  [J1-0603]
U6  LDR6282  [QFN-32-5X5MM]
USB-C  DX07S024JJ2_USB_TYPE-C  [DX07S0224JJ2_USB-C]
USB-C1  DX07S024JJ2_USB_TYPE-C  [DX07S0224JJ2_USB-C]

### Nets
5V_SYS: C47.2 C48.2 J4.1 R34.2 R35.2 U6.5(VCONN_SRC) U6.11(VDD) ; also sheet 1,8,9
GND: C8.1 C9.1 C43.1 C44.1 C45.1 C46.1 C47.1 C48.1 J4.4 Q3.2(S) Q4.2(S) R30.1 R32.1 U6.EP(PGND) USB-C1.A1(GND) USB-C1.A12(GND) USB-C1.B1(GND) USB-C1.B12(GND) USB-C1.SHIELD0(SHIELD) USB-C1.SHIELD1(SHIELD) USB-C1.SHIELD2(SHIELD) USB-C1.SHIELD3(SHIELD) USB-C.A1(GND) USB-C.A12(GND) USB-C.B1(GND) USB-C.B12(GND) USB-C.SHIELD0(SHIELD) USB-C.SHIELD1(SHIELD) USB-C.SHIELD2(SHIELD) USB-C.SHIELD3(SHIELD) ; also sheet 1,2,3,4,5,6,8,9
I2C-SCL: U6.13(DET) ; also sheet 1
I2C-SDA: U6.17(GPIO5) ; also sheet 1
N$40: R25.2 U6.3(C0CC1)
N$41: R24.2 U6.4(C0CC2)
N$42: R23.2 U6.6(C1CC1)
N$43: R7.2 U6.7(C1CC2)
N$44: C45.2 U6.10(LDO_CAP)
N$45: C46.2 U6.12(SAR_ADC_REF)
N$53: Q1.4(G) R26.2
N$54: Q2.4(G) R29.2
N$57: Q3.1(G) R30.2 R31.1
N$59: Q4.1(G) R32.2 R33.2
N$67: R36.2 U6.14(SWDIO)
N$68: R37.2 U6.15(SWCLK)
PORT0-CC1: C44.2 R25.1 USB-C.A5(CC1)
PORT0-CC2: C43.2 R24.1 USB-C.B5(CC2)
PORT0_EN: R26.1 R27.1 U6.32(GPIO13)
PORT0_VBUS: D5.1(IN) Q1.5(D) Q1.6(D) Q1.7(D) Q1.8(D) R31.2 USB-C.A4(V+) USB-C.A9(V+) USB-C.B4(V+) USB-C.B9(V+)
PORT0_VBUS_DET: Q3.3(D) R34.1 U6.22(C0_VBUS_DET)
PORT1-CC1: C9.2 R23.1 USB-C1.A5(CC1)
PORT1-CC2: C8.2 R7.1 USB-C1.B5(CC2)
PORT1_EN: R28.1 R29.1 U6.31(GPIO12)
PORT1_VBUS: D6.1(IN) Q2.5(D) Q2.6(D) Q2.7(D) Q2.8(D) R33.1 USB-C1.A4(V+) USB-C1.A9(V+) USB-C1.B4(V+) USB-C1.B9(V+)
PORT1_VBUS_DET: Q4.3(D) R35.1 U6.21(C1_VBUS_DET)
SWCLK: J3.1 R37.1
SWDIO: J3.2 R36.1
UART_USB_RX: J4.3 U6.28(UART_RX)
UART_USB_TX: J4.2 U6.27(UART_TX)
UARTUSB_N: USB-C1.A7(D-) USB-C1.B7(D-) ; also sheet 9
UARTUSB_P: USB-C1.A6(D+) USB-C1.B6(D+) ; also sheet 9
VCC_IN: D5.2(OUT) D6.2(OUT) Q1.1(S) Q1.2(S) Q1.3(S) Q2.1(S) Q2.2(S) Q2.3(S) R27.2 R28.2 ; also sheet 8
Unconnected: U6.1(VBUS_DET) U6.2(GPIO1) U6.8(GPIO2) U6.9(GPIO3) U6.16(GPIO4) U6.18(GPIO6) U6.19(GPIO7) U6.20(NRST) U6.23(GPIO8) U6.24(GPIO9) U6.25(GPIO10) U6.26(GPIO11) U6.29(C0_VEN) U6.30(C1_VEN) USB-C1.A2(TX1+) USB-C1.A3(TX1-) USB-C1.A8(SBU1) USB-C1.A10(RX2-) USB-C1.A11(RX2+) USB-C1.B2(TX2+) USB-C1.B3(TX2-) USB-C1.B8(SBU2) USB-C1.B10(RX1-) USB-C1.B11(RX1+) USB-C.A2(TX1+) USB-C.A3(TX1-) USB-C.A6(D+) USB-C.A7(D-) USB-C.A8(SBU1) USB-C.A10(RX2-) USB-C.A11(RX2+) USB-C.B2(TX2+) USB-C.B3(TX2-) USB-C.B6(D+) USB-C.B7(D-) USB-C.B8(SBU2) USB-C.B10(RX1-) USB-C.B11(RX1+)

## Sheet 8 of 9
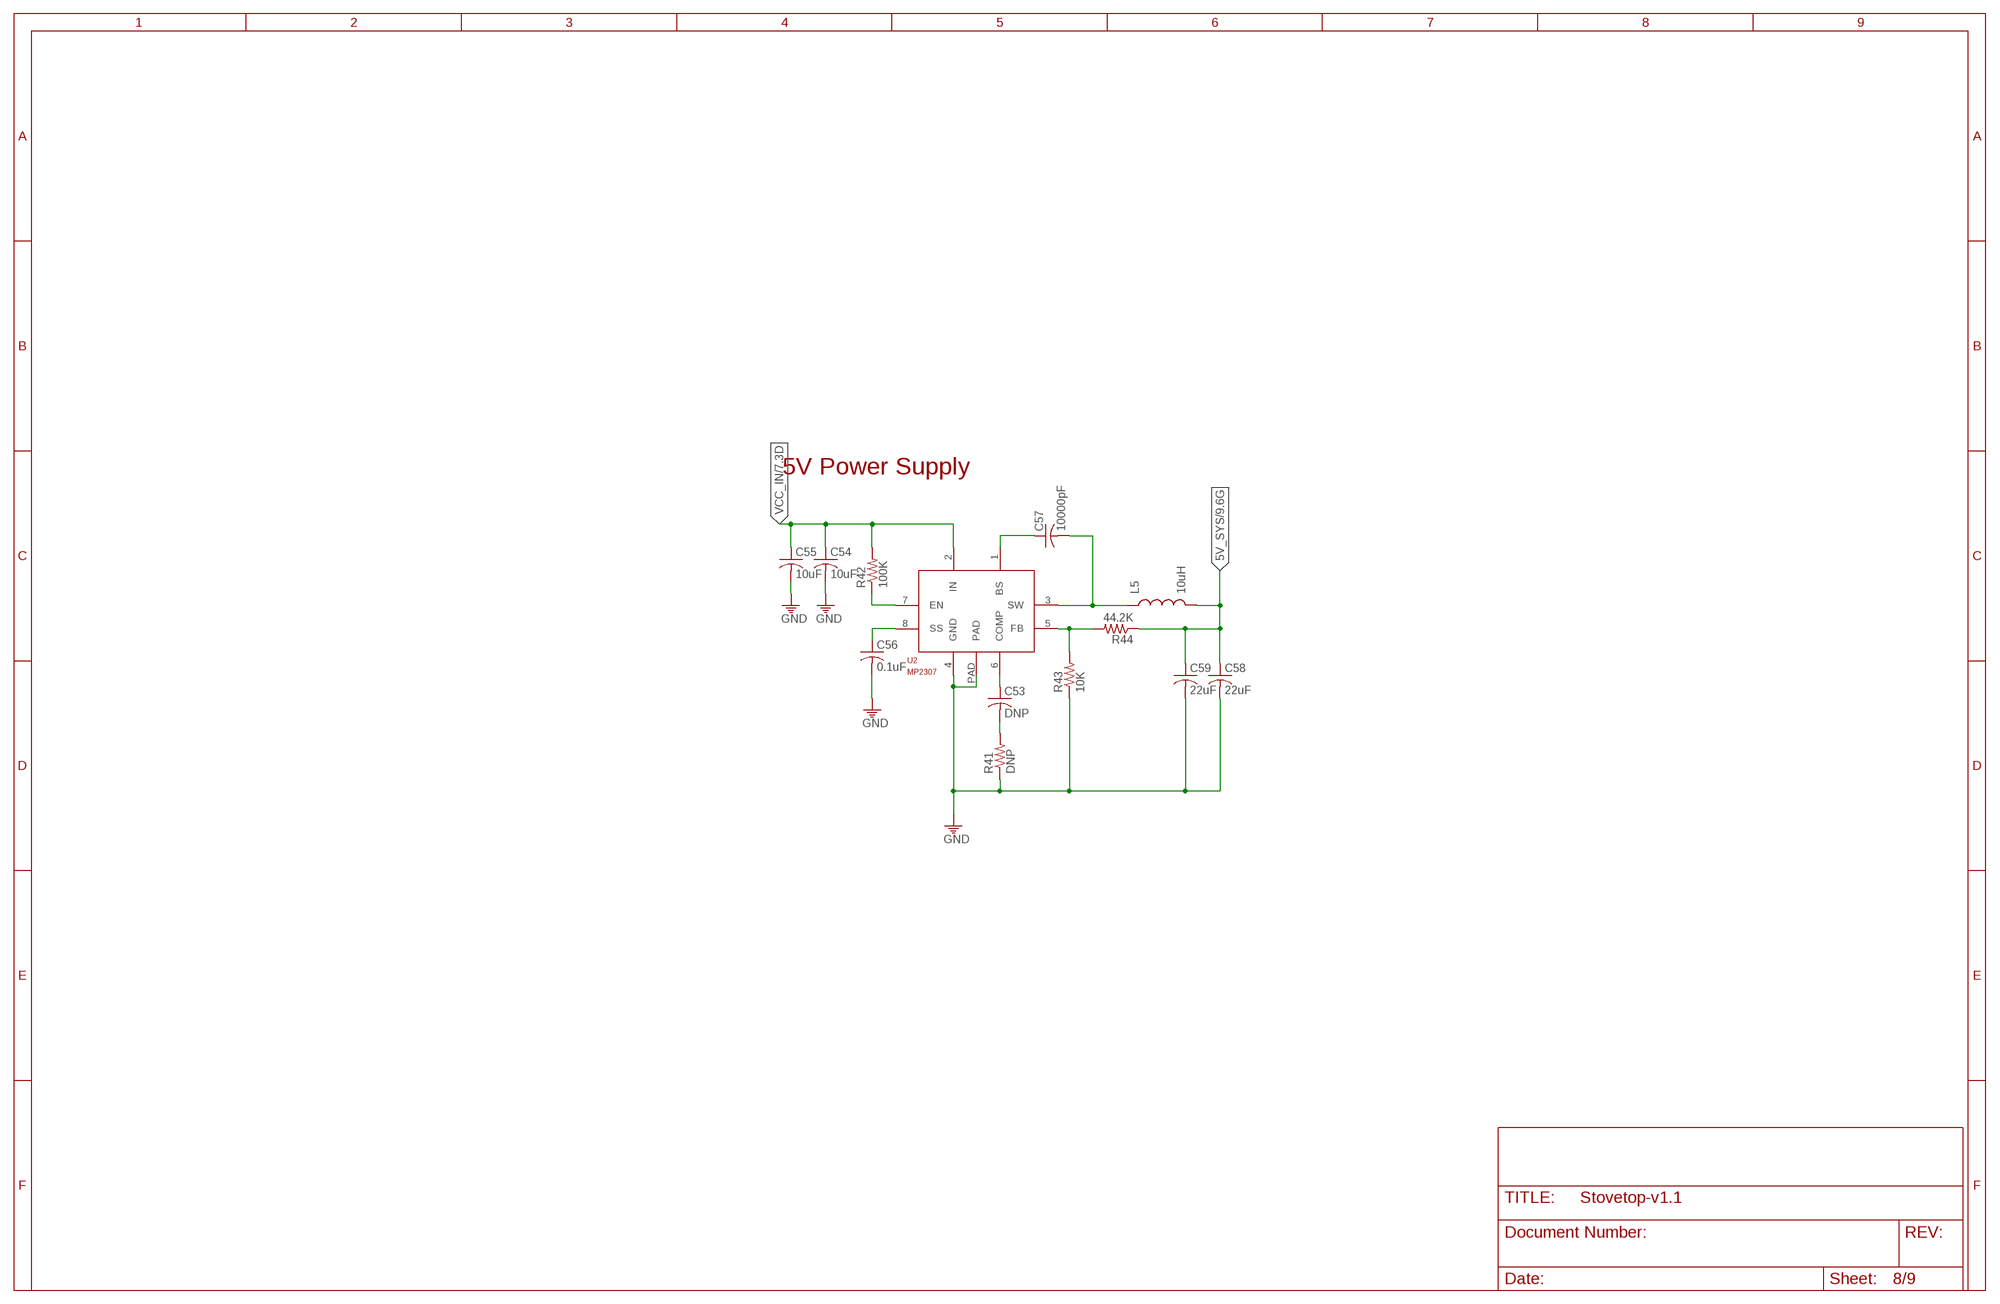
[diagram p7: schematic, sheet 8]

### Parts
C53  DNP  C-USC0402  [C0402]
C54  10uF  C-USC0603  [C0603]
C55  10uF  C-USC0603  [C0603]
C56  0.1uF  C-USC0402  [C0402]
C57  10000pF  C-USC0603  [C0603]
C58  22uF  C-USC0805  [C0805]
C59  22uF  C-USC0805  [C0805]
L5  10uH  INDUCTORNR8040  [INDUCTOR_NR8040]
R41  DNP  R-US_R0402  [R0402]
R42  100K  R-US_R0402  [R0402]
R43  10K  R-US_R0402  [R0402]
R44  44.2K  R-US_R0402  [R0402]
U2  MP2307  [SOIC-8-PAD]

### Nets
5V_SYS: C58.1 C59.1 L5.P$2 R44.1 ; also sheet 1,7,9
GND: C54.2 C55.2 C56.2 C58.2 C59.2 R41.1 R43.1 U2.4(GND) U2.PAD ; also sheet 1,2,3,4,5,6,7,9
N$52: R42.1 U2.7(EN)
N$55: C56.1 U2.8(SS)
N$56: C53.2 R41.2
N$58: C53.1 U2.6(COMP)
N$60: C57.1 U2.1(BS)
N$61: C57.2 L5.P$1 U2.3(SW)
N$62: R43.2 R44.2 U2.5(FB)
VCC_IN: C54.1 C55.1 R42.2 U2.2(IN) ; also sheet 7

### Notes on the sheet
- 5V Power Supply

## Sheet 9 of 9
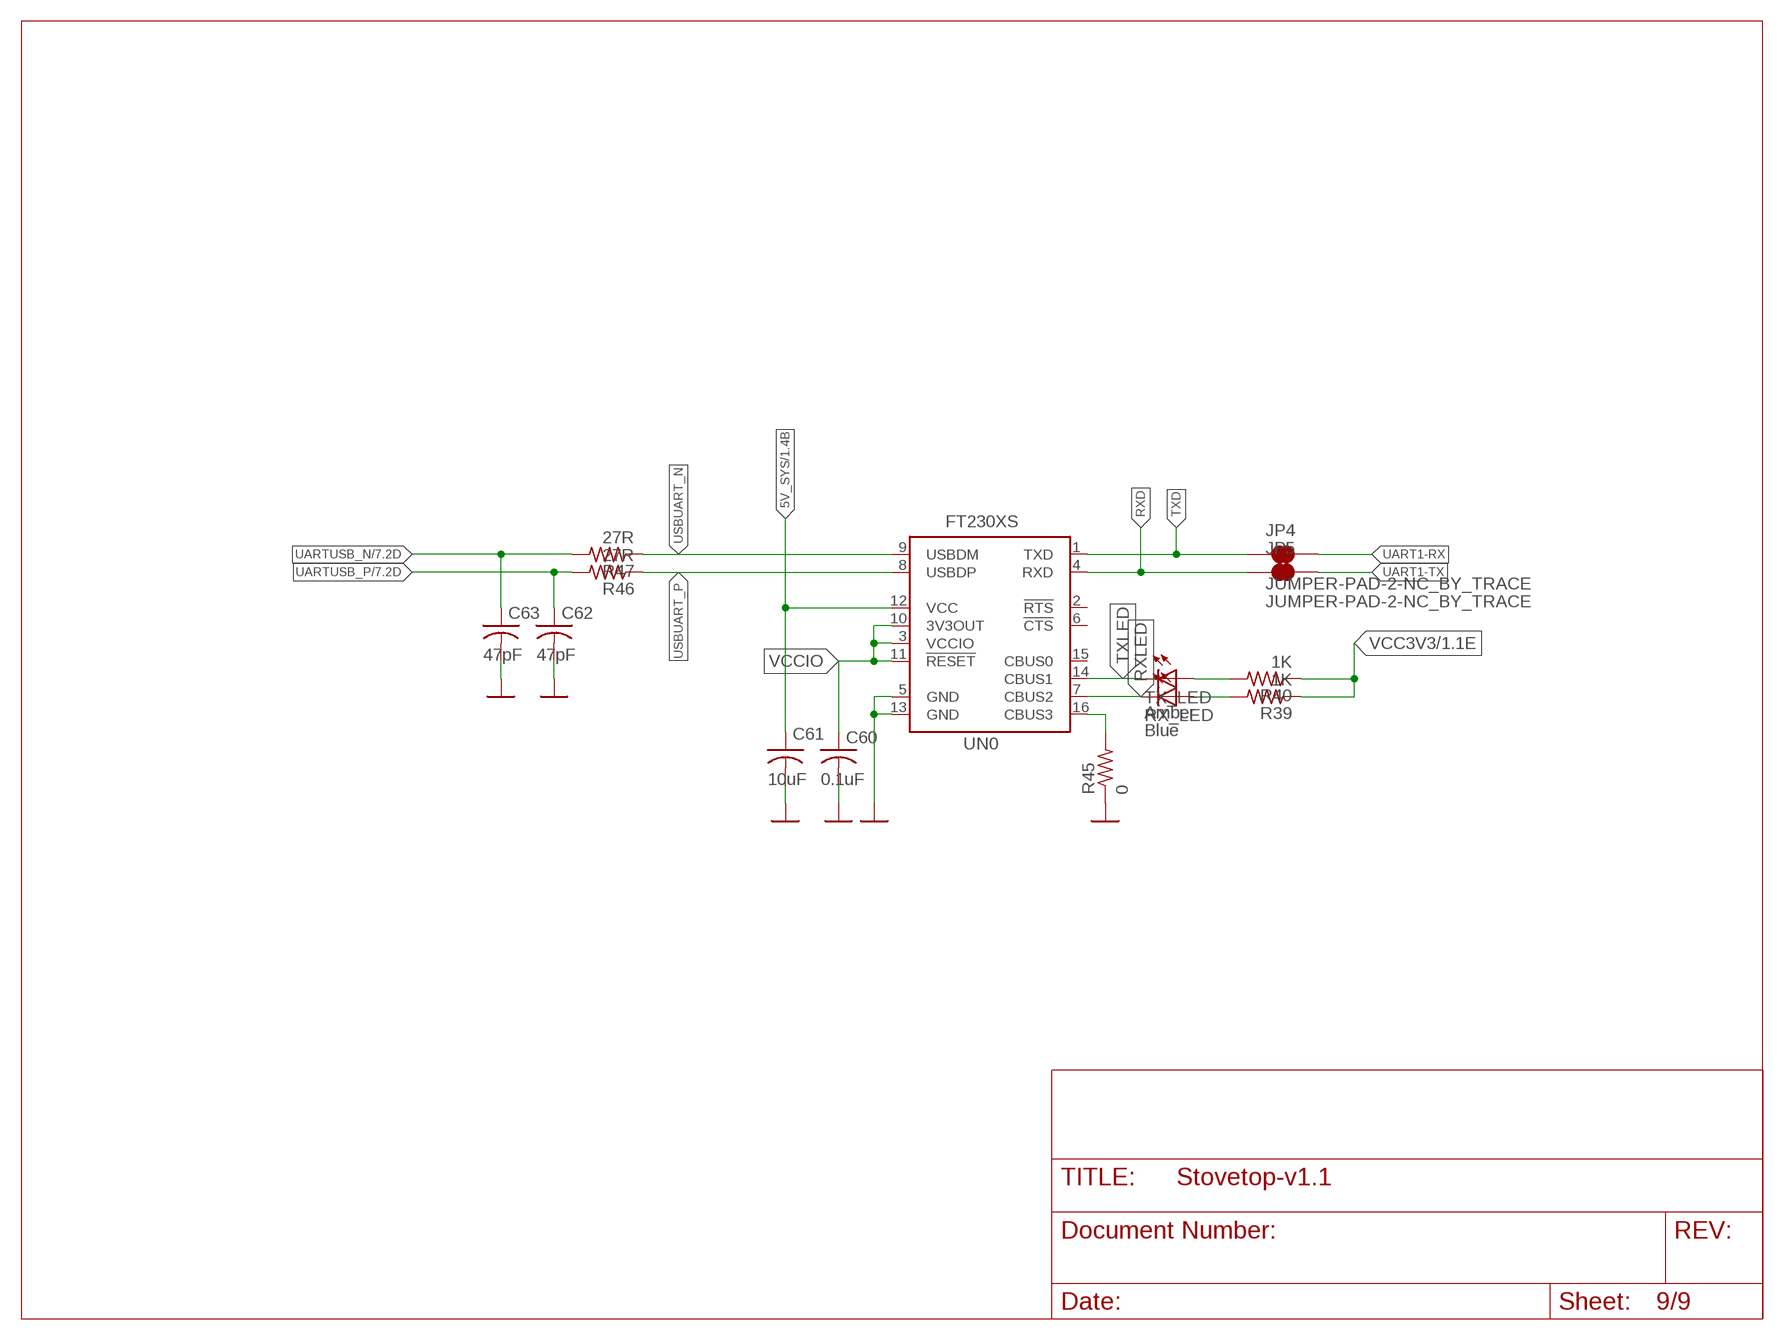
[diagram p8: schematic, sheet 9]

### Parts
C60  0.1uF  C-USC0402  [C0402]
C61  10uF  C-USC0402  [C0402]
C62  47pF  C-USC0402  [C0402]
C63  47pF  C-USC0402  [C0402]
JP4  JUMPER-PAD-2-NC_BY_TRACE  [PAD-JUMPER-2-NC_BY_TRACE_YES_SILK]
JP5  JUMPER-PAD-2-NC_BY_TRACE  [PAD-JUMPER-2-NC_BY_TRACE_YES_SILK]
R39  1K  R-US_R0402  [R0402]
R40  1K  R-US_R0402  [R0402]
R45  0  R-US_R0402  [R0402]
R46  27R  R-US_R0402  [R0402]
R47  27R  R-US_R0402  [R0402]
RX_LED  Blue  LED805  [LED-805]
TX_LED  Amber  LED805  [LED-805]
UN0  FT230XS  [SSOP-16]

### Nets
5V_SYS: C61.1 UN0.12(VCC) ; also sheet 1,7,8
GND: C60.2 C61.2 C62.2 C63.2 R45.1 UN0.5(GND) UN0.13(GND) ; also sheet 1,2,3,4,5,6,7,8
N$63: R45.2 UN0.16(CBUS3)
N$64: R39.2 RX_LED.A
N$65: R40.2 TX_LED.A
RXD: JP5.1 UN0.4(RXD)
RXLED: RX_LED.C UN0.7(CBUS2)
TXD: JP4.1 UN0.1(TXD)
TXLED: TX_LED.C UN0.14(CBUS1)
UART1-RX: JP4.2 ; also sheet 1
UART1-TX: JP5.2 ; also sheet 1
UARTUSB_N: C63.1 R47.2 ; also sheet 7
UARTUSB_P: C62.1 R46.2 ; also sheet 7
USBUART_N: R47.1 UN0.9(USBDM)
USBUART_P: R46.1 UN0.8(USBDP)
VCC3V3: R39.1 R40.1 ; also sheet 1,2,3,4,5
VCCIO: C60.1 UN0.3(VCCIO) UN0.10(3V3OUT) UN0.11(!RESET)
Unconnected: UN0.2(!RTS) UN0.6(!CTS) UN0.15(CBUS0)

## Library data of the parts
C1-C5 C12-C16 = rcl:C-EU: CAPACITOR, European symbol
C6 C17-C42 = CHIP_HDMI:CAPACITOR
C7 = Keyboard v0_5:C1206_22UF_50V_10%; DESCRIPTION: CAP ceramic smd 20% 35V 1206; FOOTPRINT: C1206; LINK: http://www.digikey.com/product-detail/en/C3216X5R1V226M160AC/445-8045-1-ND/2792165; MFG: DIGIKEY; MFG_PN: 445-8045-1-ND; PART_TYPE: C1206; PRICE: 0.01; TOLLERANCE: 20%; VENDOR: TDK; VENDOR_PART_NUMBER: C3216X5R1V226M160AC
C8 C9 C43-C48 C50 C52 C64-C67 C69 = SparkFun:CAP: Capacitor Standard 0603 ceramic capacitor, and 0.1" leaded capacitor.
C10 = Keyboard v0_5:C0402_100NF_50V_10%; DESCRIPTION: CAP CER SMD 100nF 25V 10% 0402; FOOTPRINT: C0402; LINK: http://www.digikey.co.il/product-detail/en/C1005X5R1E104K050BC/445-4964-1-ND/2093578; MFG: DIGIIKEY; MFG_PN: 445-4964-1-ND; PART_TYPE: C0402; PRICE: 0.01; TOLLERANCE: 10%; VENDOR: TDK; VENDOR_PART_NUMBER: C1005X5R1E104K050BC
C11 = rcl:CPOL-EU: POLARIZED CAPACITOR, European symbol
C49 C51 = SparkFun-Capacitors:4.7UF: 4.7µF ceramic capacitors A capacitor is a passive two-terminal electrical component used to store electrical energy temporarily in an electric field.; PROD_ID: CAP-08280
C53-C56 = GR8_Module-Eval-v0.1:C-US: CAPACITOR, American symbol
C57-C63 = CHIP_PRO_Dev-Kit-v0.1:C-US: CAPACITOR, American symbol
C68 = SparkFun:CAP_POL: Capacitor Polarized These are standard SMD and PTH capacitors. Normally 10uF, 47uF, and 100uF in electrolytic and tantalum varieties. Always verify the external diameter of the through hole cap, it varies with capacity, voltage, and manufacturer. The EIA devices should be standard.
D1-D3 = CHIP_HDMI:D-SEMTECH-RCLAMP0504S
D4 = CHIP_HDMI:B240A
D5 D6 = SMA-SS34:SMA-SS34
J1 = PocketCHIP-v1.0:98401-801-40LF
J2 = CONNECTER:HR911105A
J3 J5 = Stovetop:CONN_02: Multi connection point. Often used as Generic Header-pin footprint for 0.1 inch spaced/style header connections On any of the 0.1 inch spaced packages, you can populate with these: Break Away Headers - Straight <https://www.sparkfun.com/products/116> (PRT-00116) Break Away Male Headers - Right Angle <https://www.sparkfun.com/products/553> (PRT-00553) Female Headers <https://www.sparkfun.com/products/115> (PRT-00115) Break Away Headers - Machine Pin <https://www.sparkfun.com/products/117> (PRT-00117) Break Away Female Headers - Swiss Machine Pin <https://www.sparkfun.com/products/743> (PRT-00743) For SCREWTERMINALS and SPRING TERMINALS visit here: Screw Terimnals on SparkFun.com <https://www.sparkfun.com/search/results?term=Screw+Terminals> (5mm/3.5mm/2.54mm spacing) This device is also useful as a general connection point to wire up your design to another part of your project. Our various solder wires solder well into these plated through hole pads. Hook-Up Wire - Assortment (Stranded, 22 AWG) <https://www.sparkfun.com/products/11375> (PRT-11375) Hook-Up Wire - Assortment (Solid Core, 22 AWG) <https://www.sparkfun.com/products/11367> (PRT-11367) View the entire wire category on our website here <https://www.sparkfun.com/categories/141> Special notes: Molex polarized connector foot print use with: PRT-08233 with associated crimp pins and housings. 2.54_SCREWTERM for use with PRT-10571. 3.5mm Screw Terminal footprints for PRT-08084 5mm Screw Terminal footprints for use with PRT-08432
J4 = USB-PD_LDR:CONN_04: Multi connection point. Often used as Generic Header-pin footprint for 0.1 inch spaced/style header connections On any of the 0.1 inch spaced packages, you can populate with these: Break Away Headers - Straight <https://www.sparkfun.com/products/116> (PRT-00116) Break Away Male Headers - Right Angle <https://www.sparkfun.com/products/553> (PRT-00553) Female Headers <https://www.sparkfun.com/products/115> (PRT-00115) Break Away Headers - Machine Pin <https://www.sparkfun.com/products/117> (PRT-00117) Break Away Female Headers - Swiss Machine Pin <https://www.sparkfun.com/products/743> (PRT-00743) For SCREWTERMINALS and SPRING TERMINALS visit here: Screw Terimnals on SparkFun.com <https://www.sparkfun.com/search/results?term=Screw+Terminals> (5mm/3.5mm/2.54mm spacing) This device is also useful as a general connection point to wire up your design to another part of your project. Our various solder wires solder well into these plated through hole pads. Hook-Up Wire - Assortment (Stranded, 22 AWG) <https://www.sparkfun.com/products/11375> (PRT-11375) Hook-Up Wire - Assortment (Solid Core, 22 AWG) <https://www.sparkfun.com/products/11367> (PRT-11367) View the entire wire category on our website here <https://www.sparkfun.com/categories/141> Special notes: Molex polarized connector foot print use with SKU : PRT-08231 with associated crimp pins and housings. 1MM SMD Version SKU: PRT-10208; PROD_ID: CONN-09696
J8 = CHIP_HDMI:T_MOLEX_45171
JP1 JP2 = SparkFun-Jumpers:JUMPER-SMT_3_1-NC_PASTE: Normally closed solder jumper (1 of 2 connections) This jumper has an aperture in the stencil to allow solder paste to bridge one of the two connections. One connection is normally closed (NC), while the other is normally open (NO). Wick off the solder to open the connection. Reapply solder to reclose the connection. Apply solder to the other side instead to change the current path.
JP4 JP5 = CHIP_PRO_Dev-Kit-v0.1:JUMPER-PAD-2-NC_BY_TRACE
L1 = wuerth-elektronik:WE-KIL: SMD Wire Wound Ceramic Inductor WE-KIL - Low profile - High Q values -- Bluetooth -- Wireless LAN -- RF oscillation circuit -- IF impedance matching
L2-L4 L6 = CHIP_HDMI:ACML
L5 = GR8_Module-Eval-v0.1:INDUCTOR: Inductors; PROD_ID: NDUC-12529; VALUE: 27uH
Q1 Q2 = USB-PD_LDR:MOSFET_PCH: P-channel MOSFETs Voltage controlled devices that allow control of high current outputs. SparkFun Products: SparkFun ESP32 Thing <https://www.sparkfun.com/products/13907> SparkFun ESP8266 Thing <https://www.sparkfun.com/products/13231>; PROD_ID: TRANS-08355
Q3 Q4 = USB-PD_LDR:MOSFET-NCH: N-channel MOSFETs Voltage controlled devices that allow control of high current outputs. SparkFun Products: SparkFun OpenScale <https://www.sparkfun.com/products/13261> SparkFun Digital Sandbox <https://www.sparkfun.com/products/12651> SparkFun Monster Moto Shield <https://www.sparkfun.com/products/10182> SparkFun MOSFET Power Controller <https://www.sparkfun.com/products/11214>; PROD_ID: TRANS-11151
Q5 = RemoteSix-v0.1:CRISTALLI_0846_FTX25.000M12SM3S: 25Mhz - K7 12pF - SMD; MONTHLY_USAGE: _____; PART_NUMBER: FTX25.000M12SM3S; PRICE: _____; SUPPLIER: _____; TYPE: Cristalli
R1-R6 R10 R11 R13 = rcl:R-EU_: RESISTOR, European symbol
R7-R9 R14-R38 R48-R52 = CHIP_HDMI:RESISTOR
R12 = Keyboard v0_5:R0402_4K7_5%; DESCRIPTION: RES SMD 4.7K Ohm 1/16W 5% oHS 0402; FOOTPRINT: R0402; LINK: http://search.digikey.com/us/en/products/ERJ-2GEJ472X/P4.7KJCT-ND/147025; MFG: DIGIKEY; MFG_PN: P4.7KJCT-ND; PART_TYPE: R0402; PRICE: 0.01; TOLLERANCE: 5%; VENDOR: PANASONIC; VENDOR_PART_NUMBER: ERJ-2GEJ472X
R39-R44 R46 R47 = GR8_Module-Eval-v0.1:R-US_: RESISTOR, American symbol
R45 = CHIP_PRO_Dev-Kit-v0.1:R-US_: RESISTOR, American symbol
RX_LED TX_LED = dp_devices:LED
S1 = RemoteSix-v0.1:KMR221GLFS_KMR221GLFS: Switch Tactile N.O. SPST Button Gull Wing 0.05A 32VDC 1VA 200000Cycles 2N SMD Automotive T/R; AVAILABILITY: Good; DESCRIPTION: Switch Tactile N.O. SPST Button Gull Wing 0.05A 32VDC 1VA 200000Cycles 2N SMD Automotive T/R; MF: C&K Components; MP: KMR221GLFS; PACKAGE: None; PRICE: 0.28 USD
SJ3 = SparkFun:SOLDERJUMPER: Solder Jumper Standard SMD solder jumper. Used to automate production. Two varients : Normally Open and Normally Closed are the same, but have different paste layers. NC will have a large amount of paste and should jumper during reflow.
TP1 = CHIP_HDMI:TEST_POINT
U1 = dp_devices:ENC424J600: Stand-Alone 10/100 Ethernet Controller with SPI or Parallel Interface Source: http://ww1.microchip.com/downloads/en/DeviceDoc/39935c.pdf
U2 = GR8_Module-Eval-v0.1:MP2307
U3 = Keyboard v0_5:DS2431: 1024-Bit EEPROM This chip provides a 4x256 Bit EEPROM, which can be programmed@5V. Write protection and OTP emulation are available, too. Author: Jan Kandziora <jjj@gmx.de>; DESCRIPTION: IC, 1024-Bit, 1-Wire EEPROM, TSOC6; FOOTPRINT: TSOC6; LINK: http://www.digikey.com/product-detail/en/DS2431P%2BT%26R/DS2431P%2BT%26RCT-ND/3647900; MFG: DIGIKEY; MFG_PN: DS2431P+T&RCT-ND; PART_TYPE: IC; PRICE: 0.98; VENDOR: MAXIM; VENDOR_PART_NUMBER: DS2431P+T&R
U4 = CHIP_HDMI:CH7053A
U5 = CHIP_HDMI:LP5907MFX
U6 = USB-PD_LDR:LDR6282
U7 = SparkFun:PCM1803: 24-bit ADC
UN0 = ftdichip:FT230X
USB-C USB-C1 = Tristan Robitaille's Library:DX07S024JJ2_USB_TYPE-C: JAE DX07S024JJ2 USB Type-C Connector ***Footprint contains plated drill holes (2mm diameter) instead of plated slots (easier on fabhouse)*** Technical Specifications: Mating cycles: 10,000 times Contact resistance: 40mΩ (max.) Rated current: 1.25A (max.) on pins A1, A4, A9, A12, B1, B4, B5, B9 and B12 0.25A (max.) on others Rated voltage: 20Vrms Datasheet <https://www.jae.com/z-en/pdf_download_exec.cfm?param=MB-0297-3E_DX07.pdf> Digi-Key part #: 670-2794-6-ND <http://www.digikey.com/product-detail/en/jae-electronics/DX07S024JJ2R1300/670-2794-6-ND/5246069> Mouser part #: 656-DX07S024JJ2R1300 <http://ca.mouser.com/ProductDetail/JAE-Electronics/DX07S024JJ2R1300/?qs=%2fha2pyFaduhsAyGD7ZqdDeHjVi4g0c8wrw%252bV08Os%252brQ5DqW1EY3Lew%3d%3d> Manufacturer part #: DX07S024JJ2R1300
Y1 = CHIP_HDMI:ABM3B
Y2 = SparkFun:OSCILLATOR